# EAGLE schematic DATALOGGER_CA_ADC_V1 (EAGLE 9.5.2)

## Sheet 1 of 11
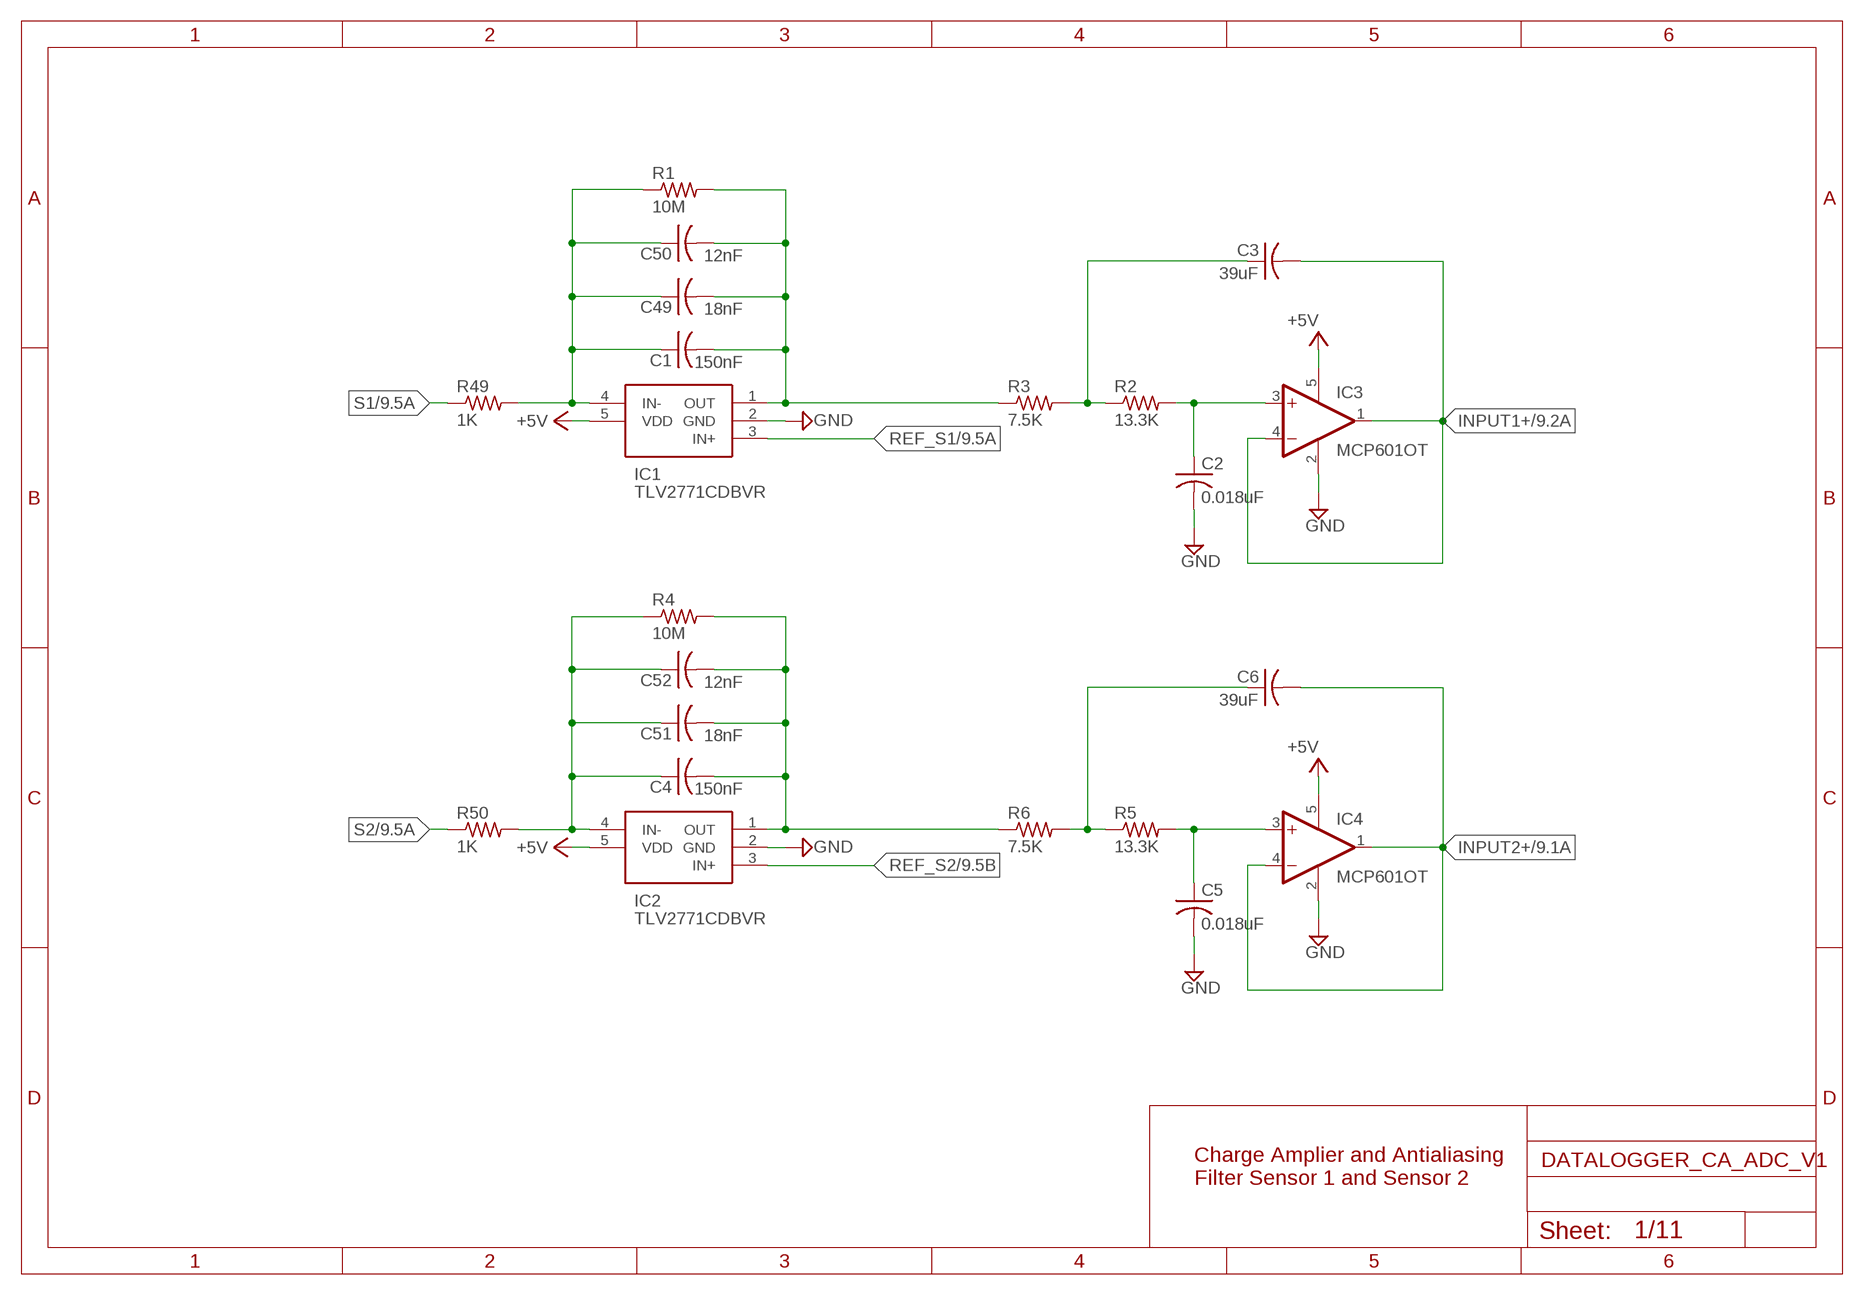
[diagram p0: schematic, sheet 1]

### Parts
C1  150nF  C-USC0805  [C0805]
C2  0.018uF  C-USC0805  [C0805]
C3  39uF  C-USC0805  [C0805]
C4  150nF  C-USC0805  [C0805]
C5  0.018uF  C-USC0805  [C0805]
C6  39uF  C-USC0805  [C0805]
C49  18nF  C-USC0805  [C0805]
C50  12nF  C-USC0805  [C0805]
C51  18nF  C-USC0805  [C0805]
C52  12nF  C-USC0805  [C0805]
IC1  TLV2771CDBVR  [SOT95P280X145-5N]
IC2  TLV2771CDBVR  [SOT95P280X145-5N]
IC3  MCP601OT  [SOT23-5]
IC4  MCP601OT  [SOT23-5]
R1  10M  R-US_R0805  [R0805]
R2  13.3K  R-US_R0805  [R0805]
R3  7.5K  R-US_R0805  [R0805]
R4  10M  R-US_R0805  [R0805]
R5  13.3K  R-US_R0805  [R0805]
R6  7.5K  R-US_R0805  [R0805]
R49  1K  R-US_R0805  [R0805]
R50  1K  R-US_R0805  [R0805]

### Nets
+5V: IC1.5(VDD) IC2.5(VDD) IC3.5(V+) IC4.5(V+) ; also sheet 2,3,4,5,6,7,8,9,10,11
GND: C2.2 C5.2 IC1.2(GND) IC2.2(GND) IC3.2(V-) IC4.2(V-) ; also sheet 2,3,4,5,6,7,8,9,10,11
INPUT1+: C3.2 IC3.1(OUT) IC3.4(-IN) ; also sheet 9
INPUT2+: C6.2 IC4.1(OUT) IC4.4(-IN) ; also sheet 9
N$2: C1.2 C49.2 C50.2 IC1.1(OUT) R1.2 R3.1
N$3: C2.1 IC3.3(+IN) R2.2
N$4: C3.1 R2.1 R3.2
N$6: C4.2 C51.2 C52.2 IC2.1(OUT) R4.2 R6.1
N$7: C5.1 IC4.3(+IN) R5.2
N$8: C6.1 R5.1 R6.2
N$49: C4.1 C51.1 C52.1 IC2.4(IN-) R4.1 R50.2
N$50: C1.1 C49.1 C50.1 IC1.4(IN-) R1.1 R49.2
REF_S1: IC1.3(IN+) ; also sheet 9,10
REF_S2: IC2.3(IN+) ; also sheet 9,10
S1: R49.1 ; also sheet 9
S2: R50.1 ; also sheet 9

### Notes on the sheet
- Charge Amplier and Antialiasing 
  Filter Sensor 1 and Sensor 2

## Sheet 2 of 11
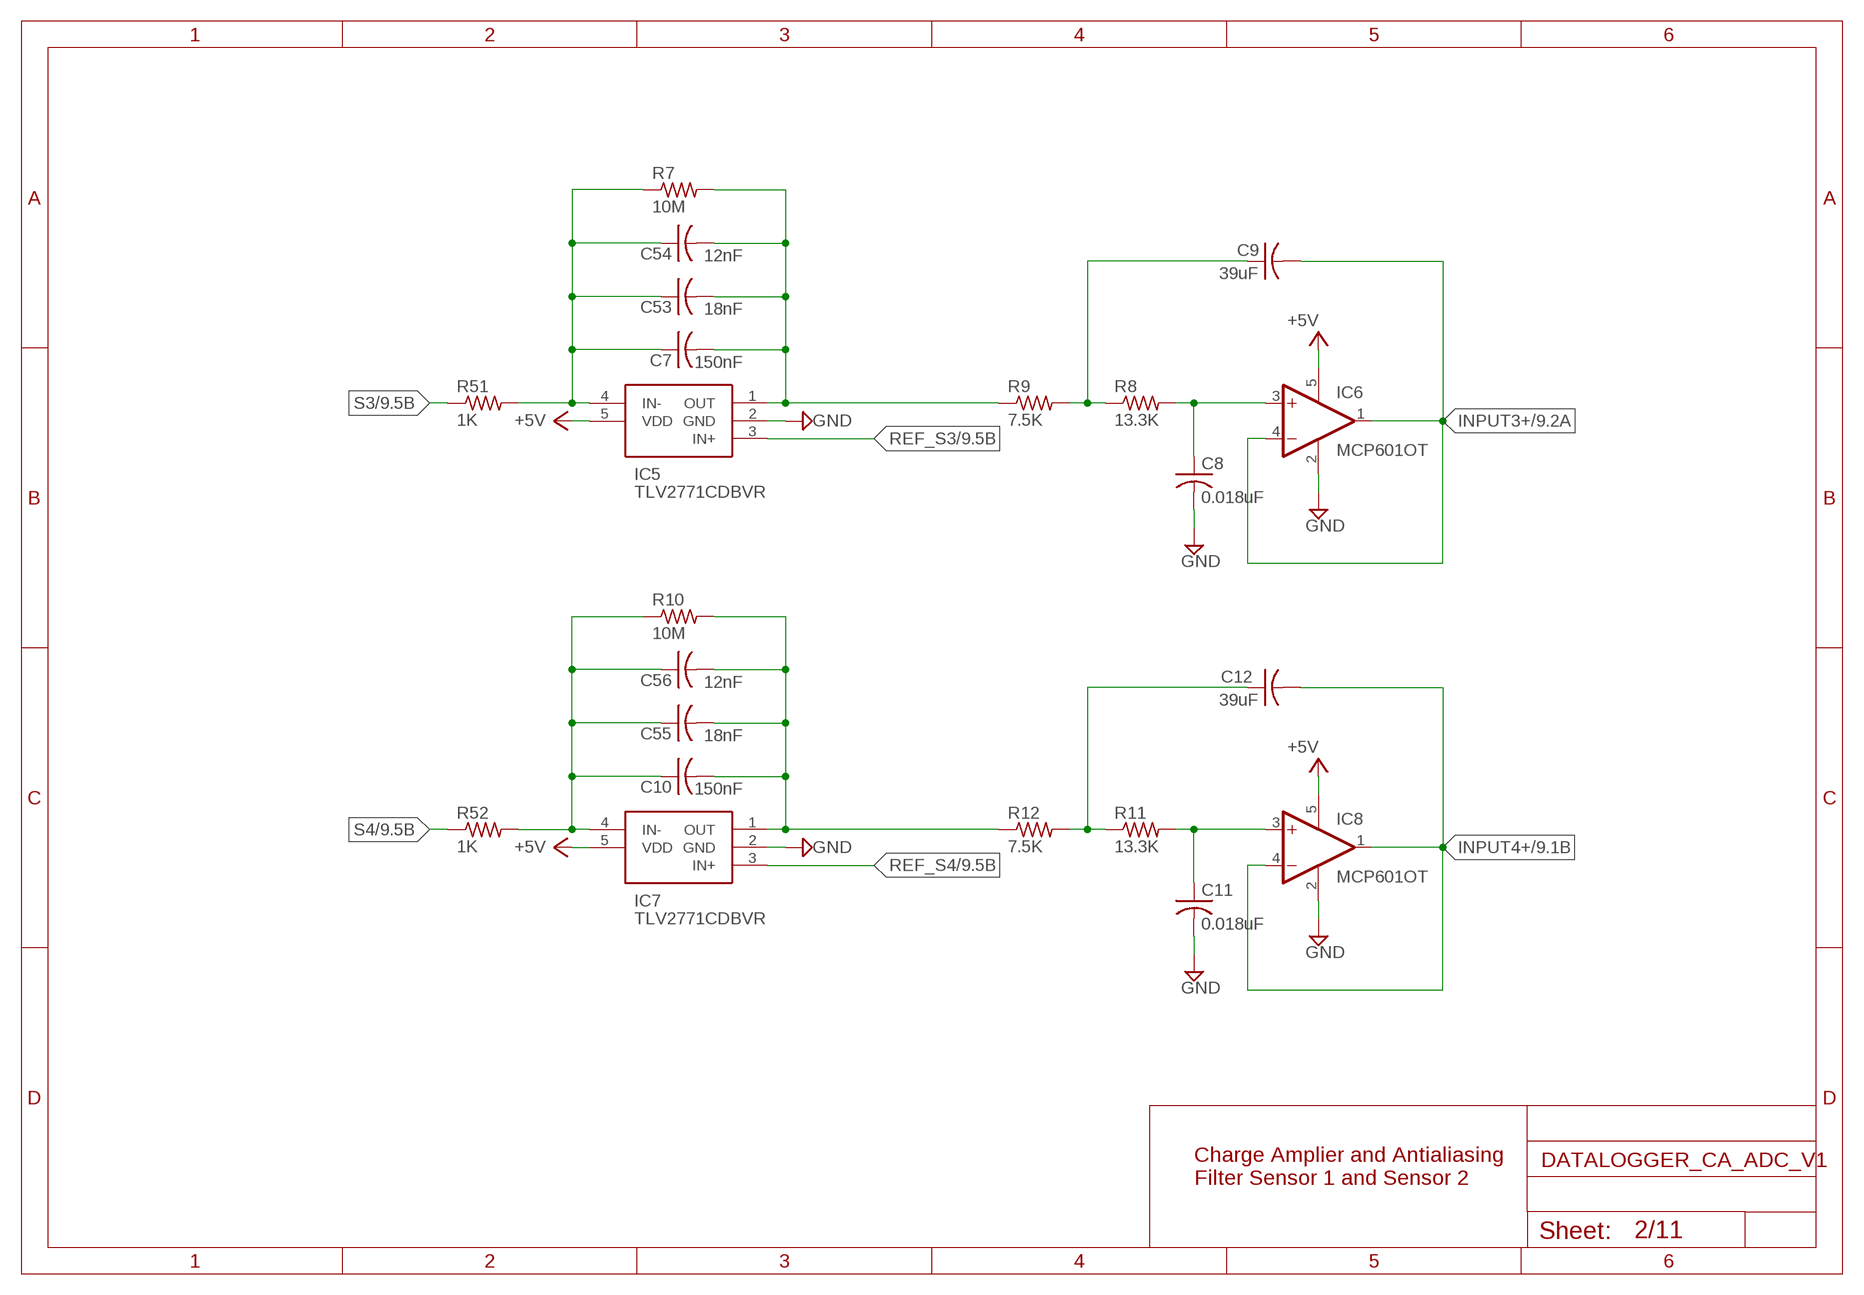
[diagram p1: schematic, sheet 2]

### Parts
C7  150nF  C-USC0805  [C0805]
C8  0.018uF  C-USC0805  [C0805]
C9  39uF  C-USC0805  [C0805]
C10  150nF  C-USC0805  [C0805]
C11  0.018uF  C-USC0805  [C0805]
C12  39uF  C-USC0805  [C0805]
C53  18nF  C-USC0805  [C0805]
C54  12nF  C-USC0805  [C0805]
C55  18nF  C-USC0805  [C0805]
C56  12nF  C-USC0805  [C0805]
IC5  TLV2771CDBVR  [SOT95P280X145-5N]
IC6  MCP601OT  [SOT23-5]
IC7  TLV2771CDBVR  [SOT95P280X145-5N]
IC8  MCP601OT  [SOT23-5]
R7  10M  R-US_R0805  [R0805]
R8  13.3K  R-US_R0805  [R0805]
R9  7.5K  R-US_R0805  [R0805]
R10  10M  R-US_R0805  [R0805]
R11  13.3K  R-US_R0805  [R0805]
R12  7.5K  R-US_R0805  [R0805]
R51  1K  R-US_R0805  [R0805]
R52  1K  R-US_R0805  [R0805]

### Nets
+5V: IC5.5(VDD) IC6.5(V+) IC7.5(VDD) IC8.5(V+) ; also sheet 1,3,4,5,6,7,8,9,10,11
GND: C8.2 C11.2 IC5.2(GND) IC6.2(V-) IC7.2(GND) IC8.2(V-) ; also sheet 1,3,4,5,6,7,8,9,10,11
INPUT3+: C9.2 IC6.1(OUT) IC6.4(-IN) ; also sheet 9
INPUT4+: C12.2 IC8.1(OUT) IC8.4(-IN) ; also sheet 9
N$1: C7.2 C53.2 C54.2 IC5.1(OUT) R7.2 R9.1
N$5: C8.1 IC6.3(+IN) R8.2
N$9: C9.1 R8.1 R9.2
N$10: C10.2 C55.2 C56.2 IC7.1(OUT) R10.2 R12.1
N$11: C11.1 IC8.3(+IN) R11.2
N$12: C12.1 R11.1 R12.2
N$51: C7.1 C53.1 C54.1 IC5.4(IN-) R7.1 R51.2
N$52: C10.1 C55.1 C56.1 IC7.4(IN-) R10.1 R52.2
REF_S3: IC5.3(IN+) ; also sheet 9,10
REF_S4: IC7.3(IN+) ; also sheet 9,10
S3: R51.1 ; also sheet 9
S4: R52.1 ; also sheet 9

### Notes on the sheet
- Charge Amplier and Antialiasing 
  Filter Sensor 1 and Sensor 2

## Sheet 3 of 11
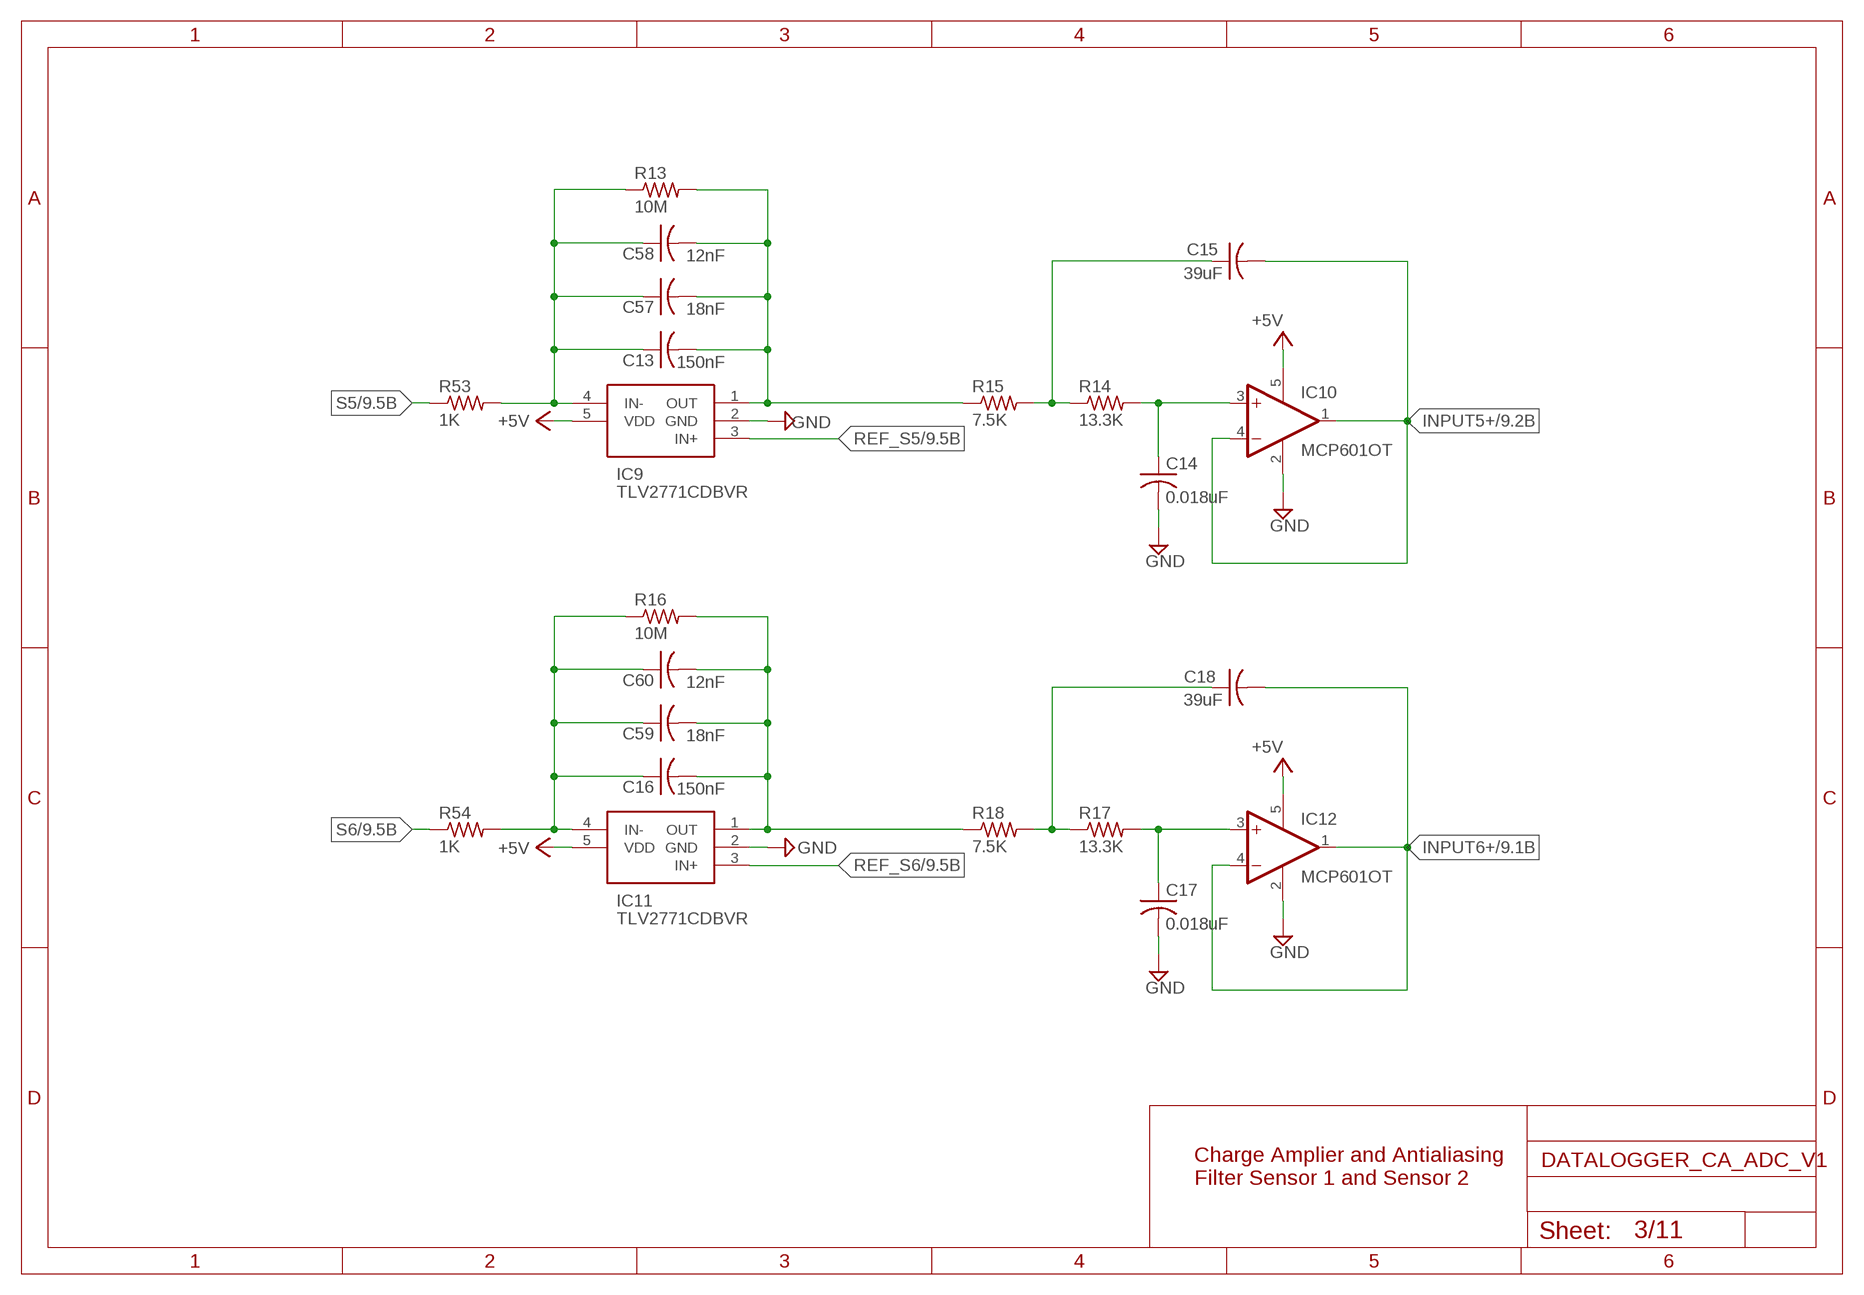
[diagram p2: schematic, sheet 3]

### Parts
C13  150nF  C-USC0805  [C0805]
C14  0.018uF  C-USC0805  [C0805]
C15  39uF  C-USC0805  [C0805]
C16  150nF  C-USC0805  [C0805]
C17  0.018uF  C-USC0805  [C0805]
C18  39uF  C-USC0805  [C0805]
C57  18nF  C-USC0805  [C0805]
C58  12nF  C-USC0805  [C0805]
C59  18nF  C-USC0805  [C0805]
C60  12nF  C-USC0805  [C0805]
IC9  TLV2771CDBVR  [SOT95P280X145-5N]
IC10  MCP601OT  [SOT23-5]
IC11  TLV2771CDBVR  [SOT95P280X145-5N]
IC12  MCP601OT  [SOT23-5]
R13  10M  R-US_R0805  [R0805]
R14  13.3K  R-US_R0805  [R0805]
R15  7.5K  R-US_R0805  [R0805]
R16  10M  R-US_R0805  [R0805]
R17  13.3K  R-US_R0805  [R0805]
R18  7.5K  R-US_R0805  [R0805]
R53  1K  R-US_R0805  [R0805]
R54  1K  R-US_R0805  [R0805]

### Nets
+5V: IC9.5(VDD) IC10.5(V+) IC11.5(VDD) IC12.5(V+) ; also sheet 1,2,4,5,6,7,8,9,10,11
GND: C14.2 C17.2 IC9.2(GND) IC10.2(V-) IC11.2(GND) IC12.2(V-) ; also sheet 1,2,4,5,6,7,8,9,10,11
INPUT5+: C15.2 IC10.1(OUT) IC10.4(-IN) ; also sheet 9
INPUT6+: C18.2 IC12.1(OUT) IC12.4(-IN) ; also sheet 9
N$13: C13.2 C57.2 C58.2 IC9.1(OUT) R13.2 R15.1
N$14: C14.1 IC10.3(+IN) R14.2
N$15: C15.1 R14.1 R15.2
N$16: C16.2 C59.2 C60.2 IC11.1(OUT) R16.2 R18.1
N$17: C17.1 IC12.3(+IN) R17.2
N$18: C18.1 R17.1 R18.2
N$53: C13.1 C57.1 C58.1 IC9.4(IN-) R13.1 R53.2
N$56: C16.1 C59.1 C60.1 IC11.4(IN-) R16.1 R54.2
REF_S5: IC9.3(IN+) ; also sheet 9,10
REF_S6: IC11.3(IN+) ; also sheet 9,10
S5: R53.1 ; also sheet 9
S6: R54.1 ; also sheet 9

### Notes on the sheet
- Charge Amplier and Antialiasing 
  Filter Sensor 1 and Sensor 2

## Sheet 4 of 11
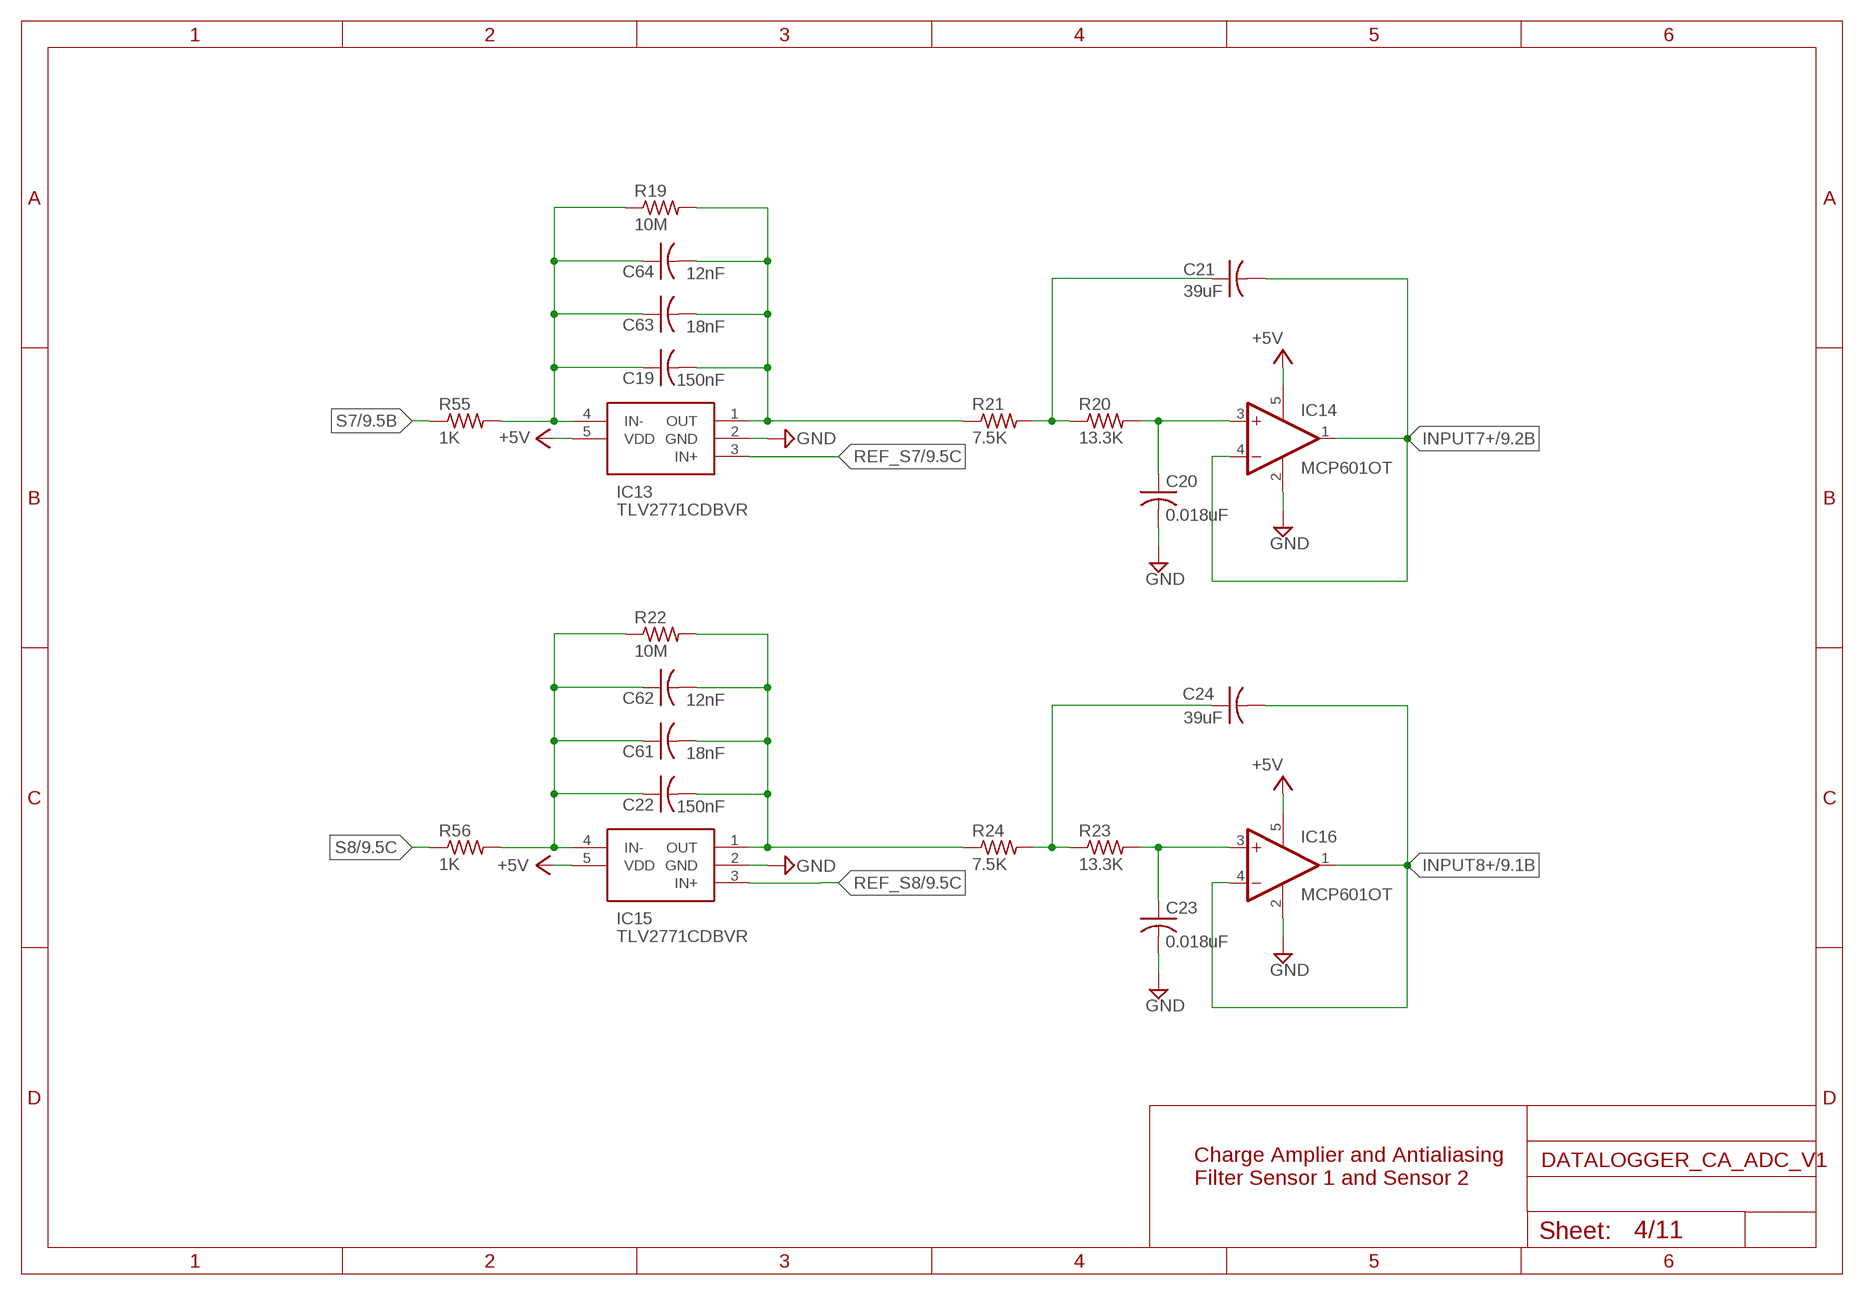
[diagram p3: schematic, sheet 4]

### Parts
C19  150nF  C-USC0805  [C0805]
C20  0.018uF  C-USC0805  [C0805]
C21  39uF  C-USC0805  [C0805]
C22  150nF  C-USC0805  [C0805]
C23  0.018uF  C-USC0805  [C0805]
C24  39uF  C-USC0805  [C0805]
C61  18nF  C-USC0805  [C0805]
C62  12nF  C-USC0805  [C0805]
C63  18nF  C-USC0805  [C0805]
C64  12nF  C-USC0805  [C0805]
IC13  TLV2771CDBVR  [SOT95P280X145-5N]
IC14  MCP601OT  [SOT23-5]
IC15  TLV2771CDBVR  [SOT95P280X145-5N]
IC16  MCP601OT  [SOT23-5]
R19  10M  R-US_R0805  [R0805]
R20  13.3K  R-US_R0805  [R0805]
R21  7.5K  R-US_R0805  [R0805]
R22  10M  R-US_R0805  [R0805]
R23  13.3K  R-US_R0805  [R0805]
R24  7.5K  R-US_R0805  [R0805]
R55  1K  R-US_R0805  [R0805]
R56  1K  R-US_R0805  [R0805]

### Nets
+5V: IC13.5(VDD) IC14.5(V+) IC15.5(VDD) IC16.5(V+) ; also sheet 1,2,3,5,6,7,8,9,10,11
GND: C20.2 C23.2 IC13.2(GND) IC14.2(V-) IC15.2(GND) IC16.2(V-) ; also sheet 1,2,3,5,6,7,8,9,10,11
INPUT7+: C21.2 IC14.1(OUT) IC14.4(-IN) ; also sheet 9
INPUT8+: C24.2 IC16.1(OUT) IC16.4(-IN) ; also sheet 9
N$19: C19.2 C63.2 C64.2 IC13.1(OUT) R19.2 R21.1
N$20: C20.1 IC14.3(+IN) R20.2
N$21: C21.1 R20.1 R21.2
N$22: C22.2 C61.2 C62.2 IC15.1(OUT) R22.2 R24.1
N$23: C23.1 IC16.3(+IN) R23.2
N$24: C24.1 R23.1 R24.2
N$54: C19.1 C63.1 C64.1 IC13.4(IN-) R19.1 R55.2
N$55: C22.1 C61.1 C62.1 IC15.4(IN-) R22.1 R56.2
REF_S7: IC13.3(IN+) ; also sheet 9,10
REF_S8: IC15.3(IN+) ; also sheet 9,10
S7: R55.1 ; also sheet 9
S8: R56.1 ; also sheet 9

### Notes on the sheet
- Charge Amplier and Antialiasing 
  Filter Sensor 1 and Sensor 2

## Sheet 5 of 11
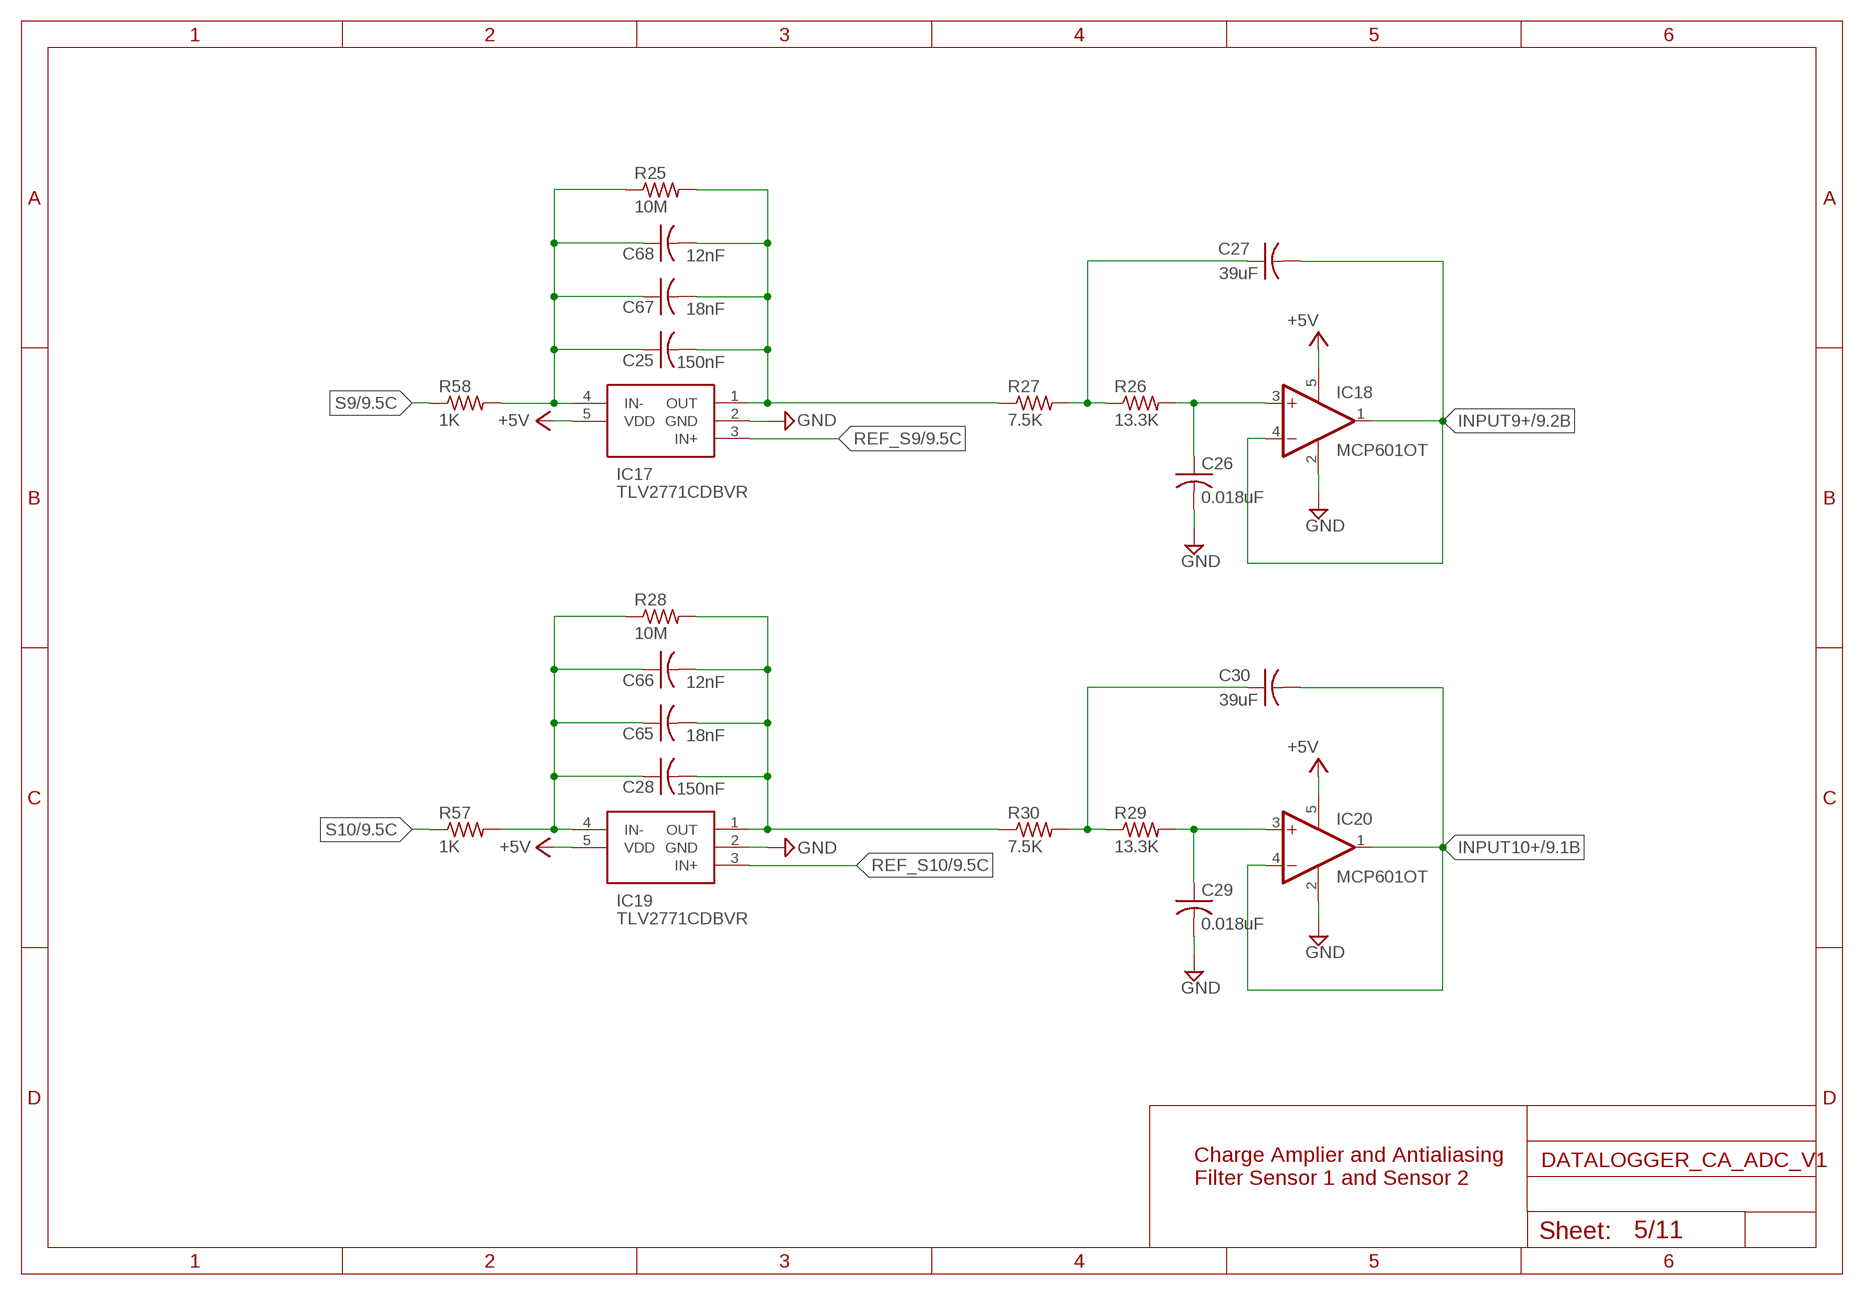
[diagram p4: schematic, sheet 5]

### Parts
C25  150nF  C-USC0805  [C0805]
C26  0.018uF  C-USC0805  [C0805]
C27  39uF  C-USC0805  [C0805]
C28  150nF  C-USC0805  [C0805]
C29  0.018uF  C-USC0805  [C0805]
C30  39uF  C-USC0805  [C0805]
C65  18nF  C-USC0805  [C0805]
C66  12nF  C-USC0805  [C0805]
C67  18nF  C-USC0805  [C0805]
C68  12nF  C-USC0805  [C0805]
IC17  TLV2771CDBVR  [SOT95P280X145-5N]
IC18  MCP601OT  [SOT23-5]
IC19  TLV2771CDBVR  [SOT95P280X145-5N]
IC20  MCP601OT  [SOT23-5]
R25  10M  R-US_R0805  [R0805]
R26  13.3K  R-US_R0805  [R0805]
R27  7.5K  R-US_R0805  [R0805]
R28  10M  R-US_R0805  [R0805]
R29  13.3K  R-US_R0805  [R0805]
R30  7.5K  R-US_R0805  [R0805]
R57  1K  R-US_R0805  [R0805]
R58  1K  R-US_R0805  [R0805]

### Nets
+5V: IC17.5(VDD) IC18.5(V+) IC19.5(VDD) IC20.5(V+) ; also sheet 1,2,3,4,6,7,8,9,10,11
GND: C26.2 C29.2 IC17.2(GND) IC18.2(V-) IC19.2(GND) IC20.2(V-) ; also sheet 1,2,3,4,6,7,8,9,10,11
INPUT9+: C27.2 IC18.1(OUT) IC18.4(-IN) ; also sheet 9
INPUT10+: C30.2 IC20.1(OUT) IC20.4(-IN) ; also sheet 9
N$25: C25.2 C67.2 C68.2 IC17.1(OUT) R25.2 R27.1
N$26: C26.1 IC18.3(+IN) R26.2
N$27: C27.1 R26.1 R27.2
N$28: C28.2 C65.2 C66.2 IC19.1(OUT) R28.2 R30.1
N$29: C29.1 IC20.3(+IN) R29.2
N$30: C30.1 R29.1 R30.2
N$57: C25.1 C67.1 C68.1 IC17.4(IN-) R25.1 R58.2
N$60: C28.1 C65.1 C66.1 IC19.4(IN-) R28.1 R57.2
REF_S9: IC17.3(IN+) ; also sheet 9,11
REF_S10: IC19.3(IN+) ; also sheet 9,11
S9: R58.1 ; also sheet 9
S10: R57.1 ; also sheet 9

### Notes on the sheet
- Charge Amplier and Antialiasing 
  Filter Sensor 1 and Sensor 2

## Sheet 6 of 11
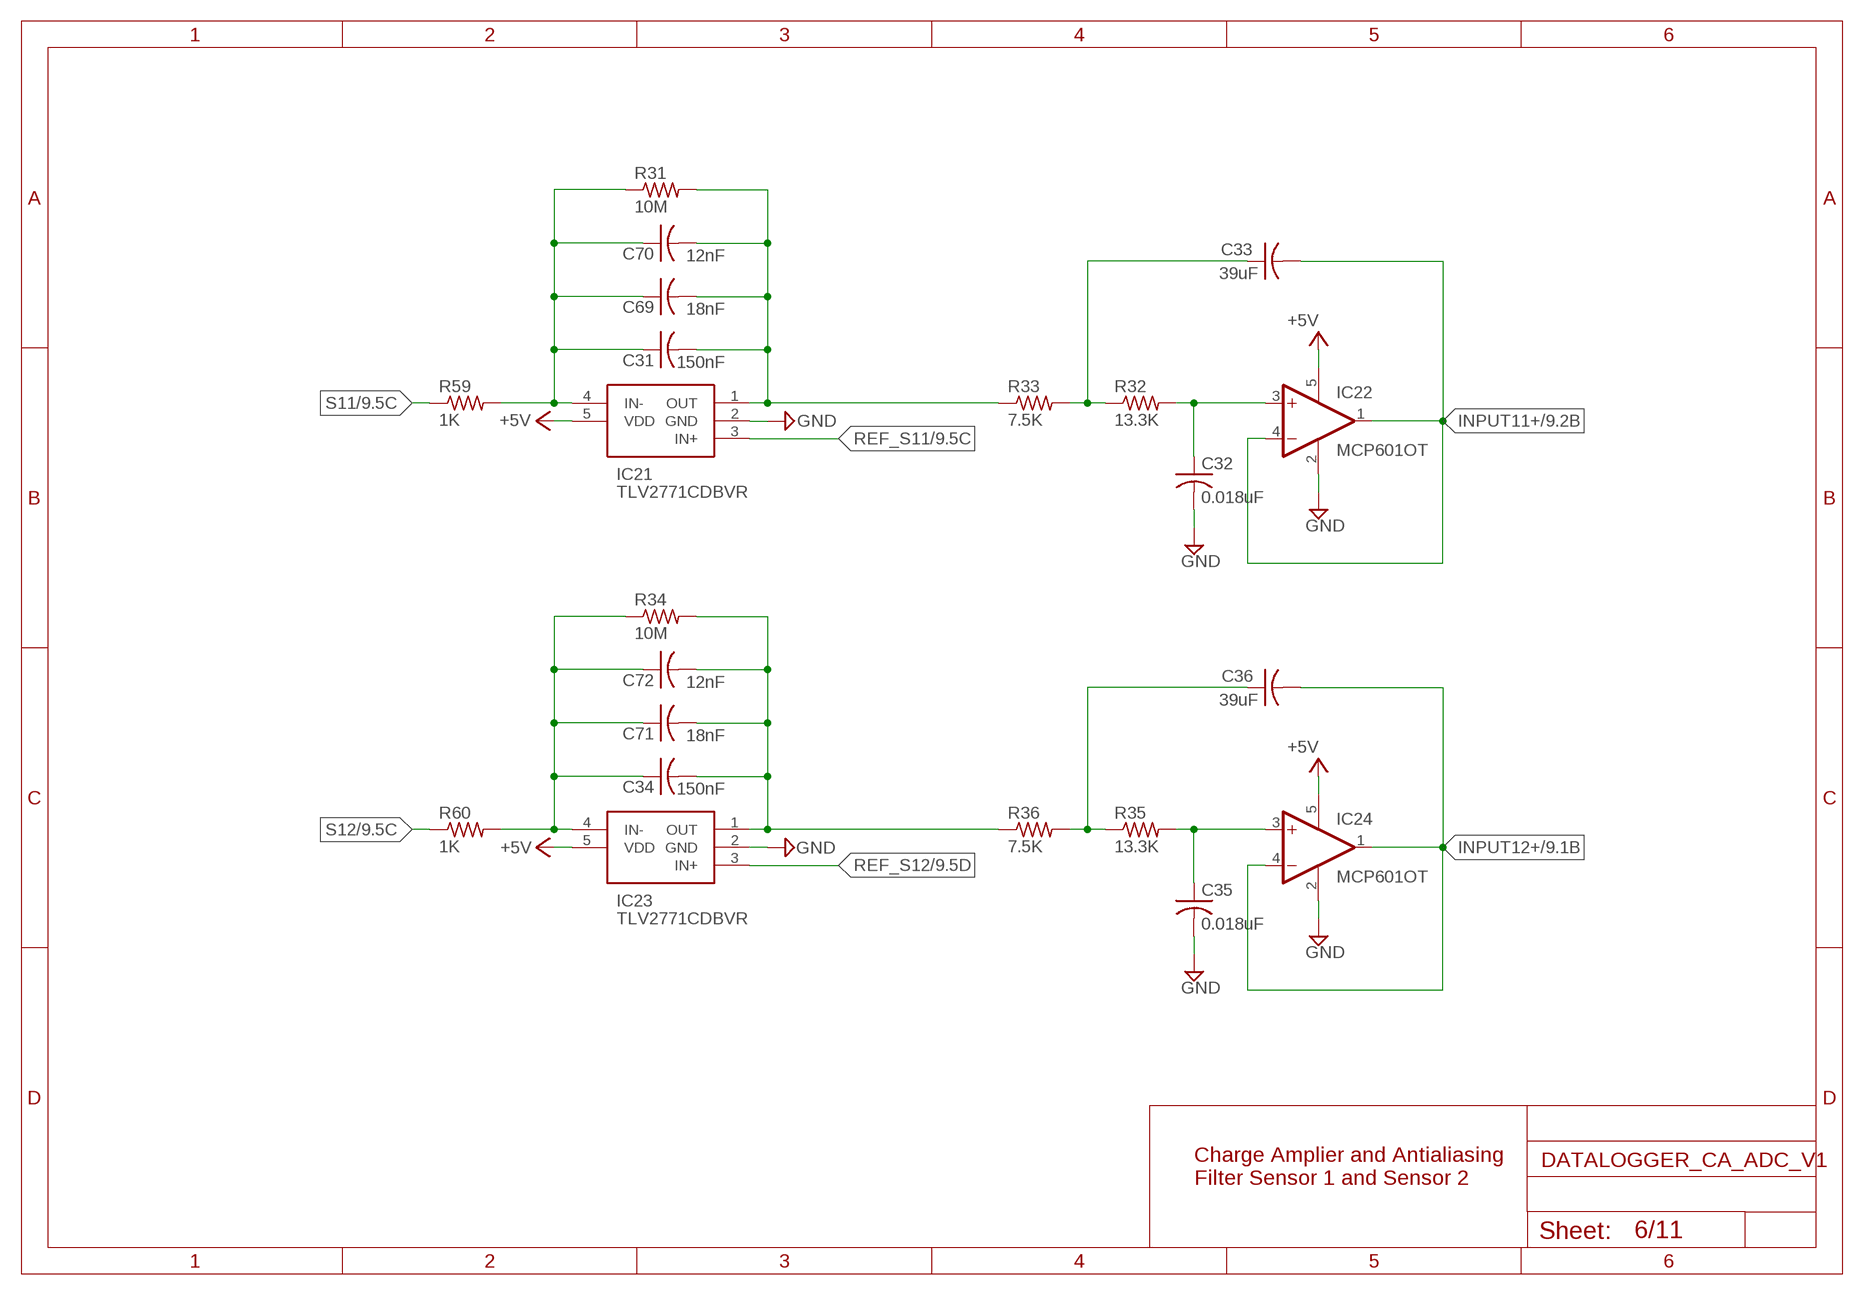
[diagram p5: schematic, sheet 6]

### Parts
C31  150nF  C-USC0805  [C0805]
C32  0.018uF  C-USC0805  [C0805]
C33  39uF  C-USC0805  [C0805]
C34  150nF  C-USC0805  [C0805]
C35  0.018uF  C-USC0805  [C0805]
C36  39uF  C-USC0805  [C0805]
C69  18nF  C-USC0805  [C0805]
C70  12nF  C-USC0805  [C0805]
C71  18nF  C-USC0805  [C0805]
C72  12nF  C-USC0805  [C0805]
IC21  TLV2771CDBVR  [SOT95P280X145-5N]
IC22  MCP601OT  [SOT23-5]
IC23  TLV2771CDBVR  [SOT95P280X145-5N]
IC24  MCP601OT  [SOT23-5]
R31  10M  R-US_R0805  [R0805]
R32  13.3K  R-US_R0805  [R0805]
R33  7.5K  R-US_R0805  [R0805]
R34  10M  R-US_R0805  [R0805]
R35  13.3K  R-US_R0805  [R0805]
R36  7.5K  R-US_R0805  [R0805]
R59  1K  R-US_R0805  [R0805]
R60  1K  R-US_R0805  [R0805]

### Nets
+5V: IC21.5(VDD) IC22.5(V+) IC23.5(VDD) IC24.5(V+) ; also sheet 1,2,3,4,5,7,8,9,10,11
GND: C32.2 C35.2 IC21.2(GND) IC22.2(V-) IC23.2(GND) IC24.2(V-) ; also sheet 1,2,3,4,5,7,8,9,10,11
INPUT11+: C33.2 IC22.1(OUT) IC22.4(-IN) ; also sheet 9
INPUT12+: C36.2 IC24.1(OUT) IC24.4(-IN) ; also sheet 9
N$31: C31.2 C69.2 C70.2 IC21.1(OUT) R31.2 R33.1
N$32: C32.1 IC22.3(+IN) R32.2
N$33: C33.1 R32.1 R33.2
N$34: C34.2 C71.2 C72.2 IC23.1(OUT) R34.2 R36.1
N$35: C35.1 IC24.3(+IN) R35.2
N$36: C36.1 R35.1 R36.2
N$58: C31.1 C69.1 C70.1 IC21.4(IN-) R31.1 R59.2
N$62: C34.1 C71.1 C72.1 IC23.4(IN-) R34.1 R60.2
REF_S11: IC21.3(IN+) ; also sheet 9,11
REF_S12: IC23.3(IN+) ; also sheet 9,11
S11: R59.1 ; also sheet 9
S12: R60.1 ; also sheet 9

### Notes on the sheet
- Charge Amplier and Antialiasing 
  Filter Sensor 1 and Sensor 2

## Sheet 7 of 11
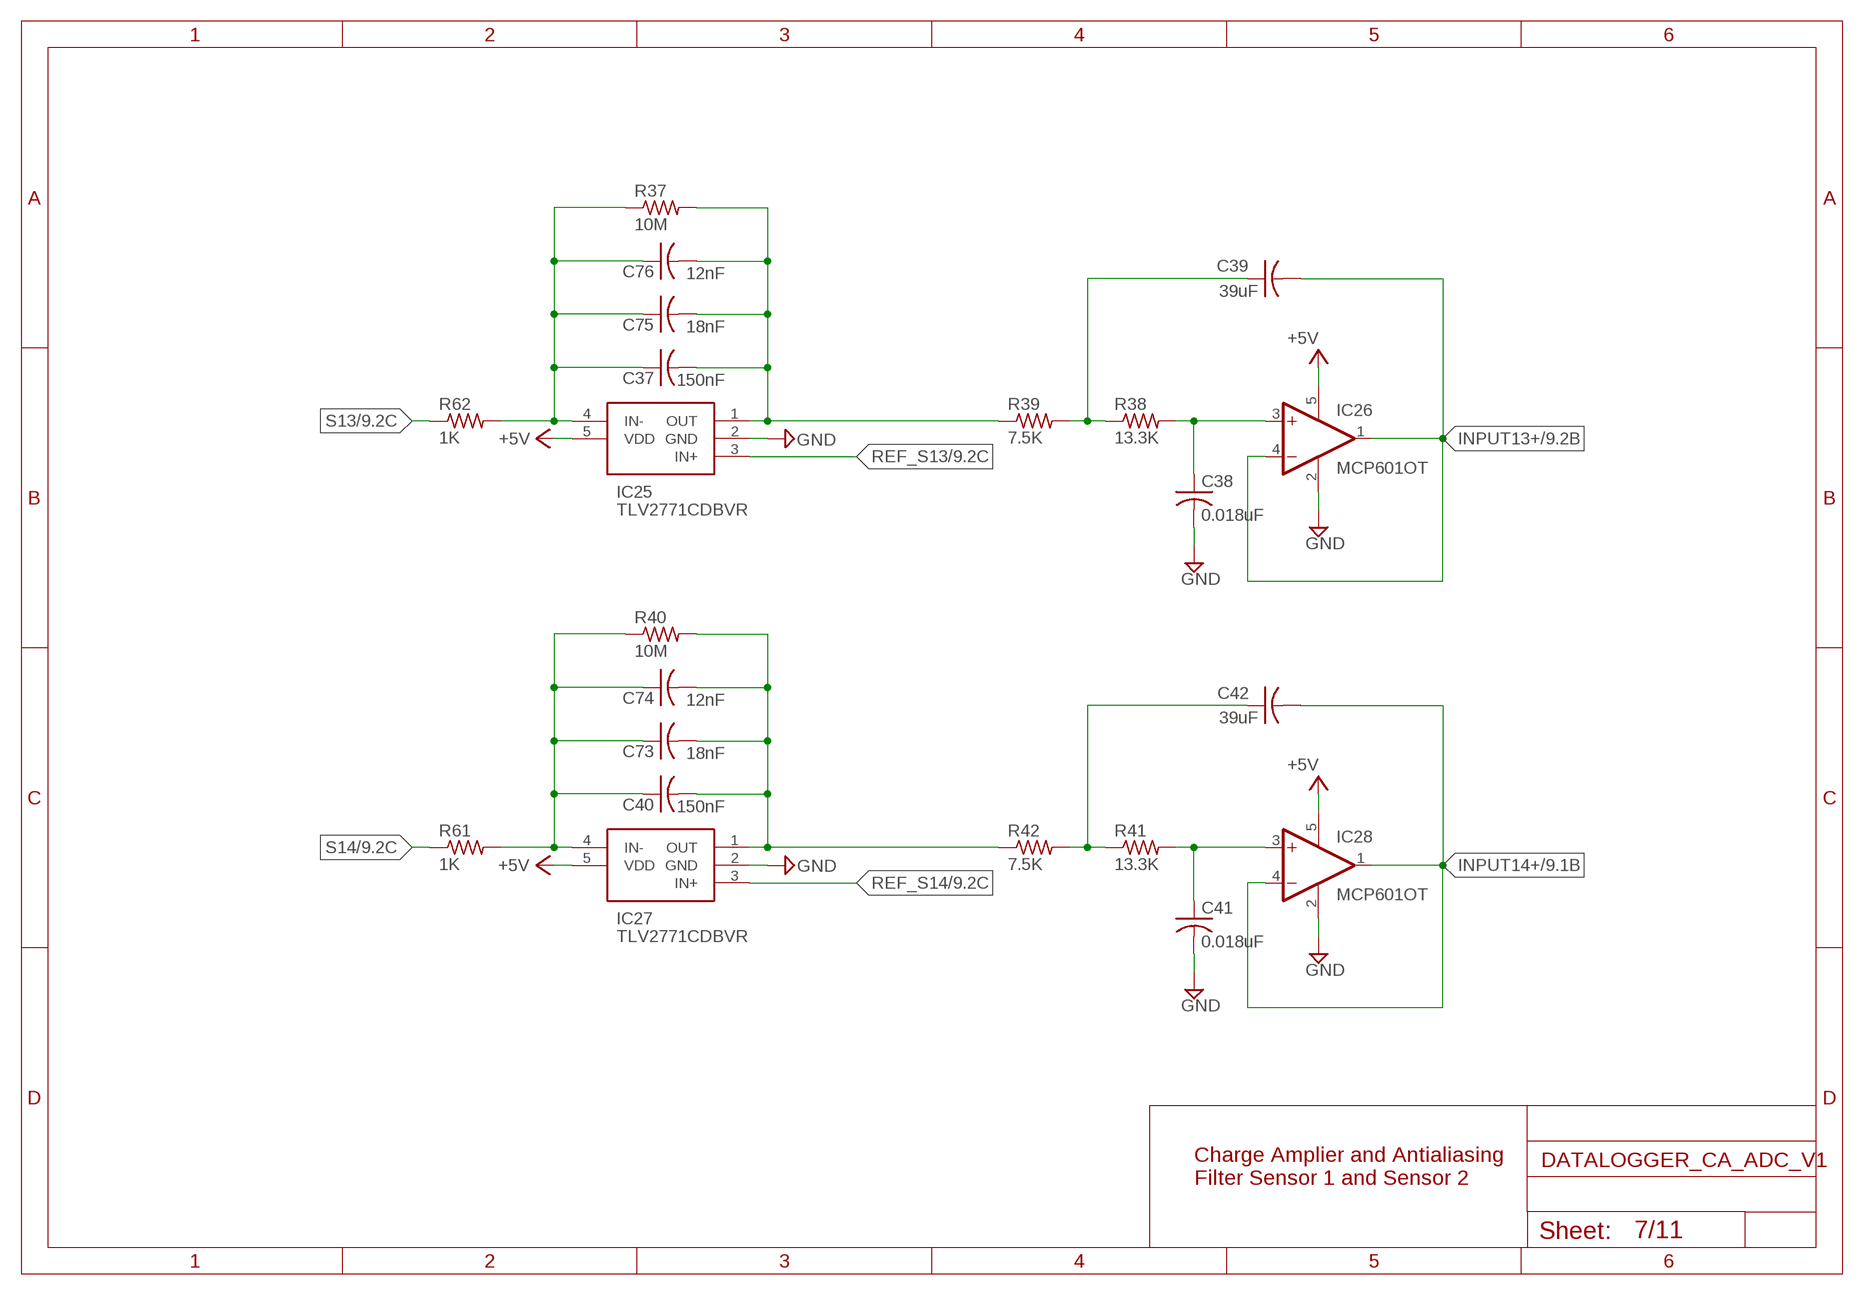
[diagram p6: schematic, sheet 7]

### Parts
C37  150nF  C-USC0805  [C0805]
C38  0.018uF  C-USC0805  [C0805]
C39  39uF  C-USC0805  [C0805]
C40  150nF  C-USC0805  [C0805]
C41  0.018uF  C-USC0805  [C0805]
C42  39uF  C-USC0805  [C0805]
C73  18nF  C-USC0805  [C0805]
C74  12nF  C-USC0805  [C0805]
C75  18nF  C-USC0805  [C0805]
C76  12nF  C-USC0805  [C0805]
IC25  TLV2771CDBVR  [SOT95P280X145-5N]
IC26  MCP601OT  [SOT23-5]
IC27  TLV2771CDBVR  [SOT95P280X145-5N]
IC28  MCP601OT  [SOT23-5]
R37  10M  R-US_R0805  [R0805]
R38  13.3K  R-US_R0805  [R0805]
R39  7.5K  R-US_R0805  [R0805]
R40  10M  R-US_R0805  [R0805]
R41  13.3K  R-US_R0805  [R0805]
R42  7.5K  R-US_R0805  [R0805]
R61  1K  R-US_R0805  [R0805]
R62  1K  R-US_R0805  [R0805]

### Nets
+5V: IC25.5(VDD) IC26.5(V+) IC27.5(VDD) IC28.5(V+) ; also sheet 1,2,3,4,5,6,8,9,10,11
GND: C38.2 C41.2 IC25.2(GND) IC26.2(V-) IC27.2(GND) IC28.2(V-) ; also sheet 1,2,3,4,5,6,8,9,10,11
INPUT13+: C39.2 IC26.1(OUT) IC26.4(-IN) ; also sheet 9
INPUT14+: C42.2 IC28.1(OUT) IC28.4(-IN) ; also sheet 9
N$37: C37.2 C75.2 C76.2 IC25.1(OUT) R37.2 R39.1
N$38: C38.1 IC26.3(+IN) R38.2
N$39: C39.1 R38.1 R39.2
N$40: C40.2 C73.2 C74.2 IC27.1(OUT) R40.2 R42.1
N$41: C41.1 IC28.3(+IN) R41.2
N$42: C42.1 R41.1 R42.2
N$59: C37.1 C75.1 C76.1 IC25.4(IN-) R37.1 R62.2
N$64: C40.1 C73.1 C74.1 IC27.4(IN-) R40.1 R61.2
REF_S13: IC25.3(IN+) ; also sheet 9,11
REF_S14: IC27.3(IN+) ; also sheet 9,11
S13: R62.1 ; also sheet 9
S14: R61.1 ; also sheet 9

### Notes on the sheet
- Charge Amplier and Antialiasing 
  Filter Sensor 1 and Sensor 2

## Sheet 8 of 11
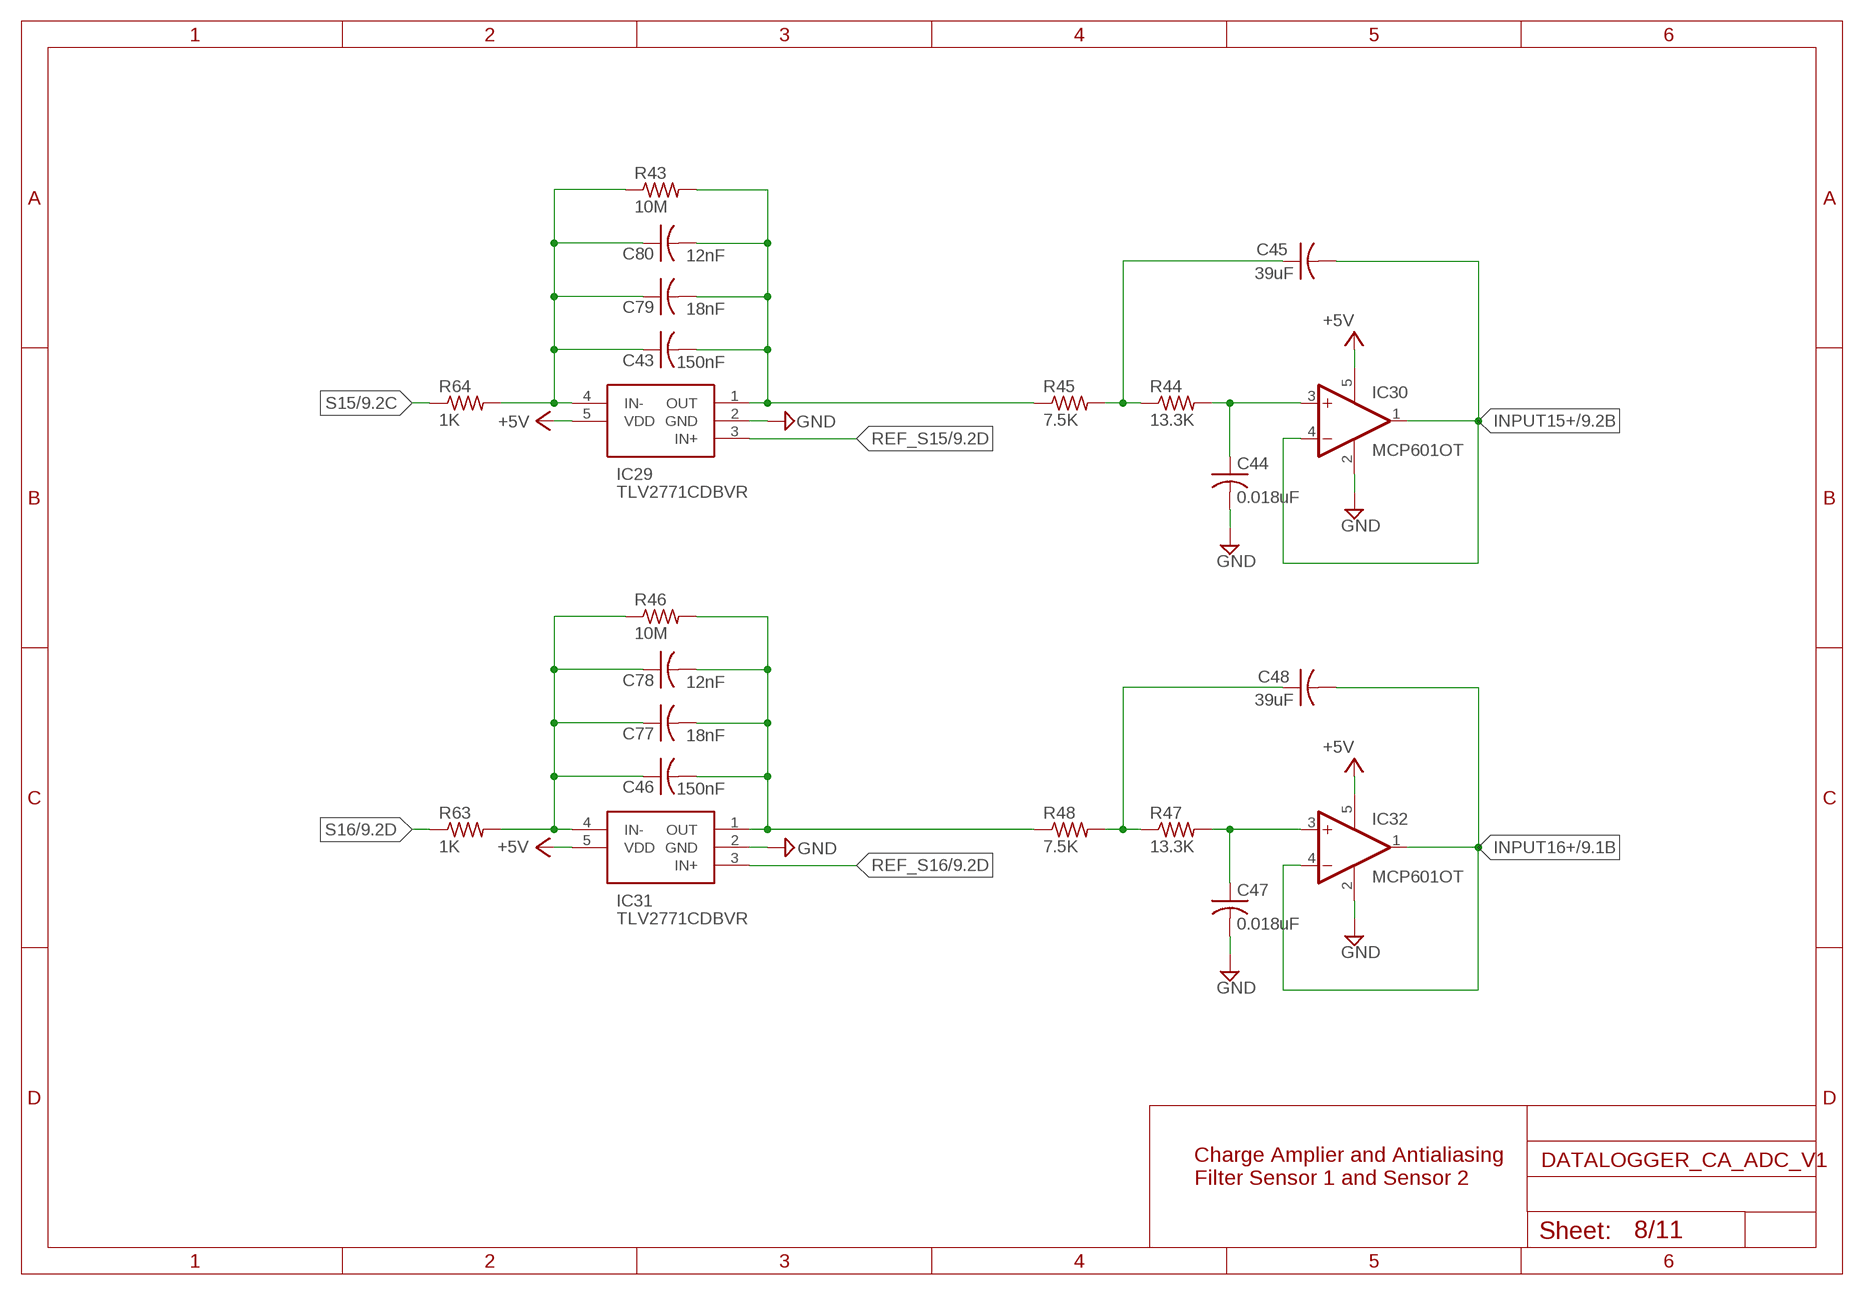
[diagram p7: schematic, sheet 8]

### Parts
C43  150nF  C-USC0805  [C0805]
C44  0.018uF  C-USC0805  [C0805]
C45  39uF  C-USC0805  [C0805]
C46  150nF  C-USC0805  [C0805]
C47  0.018uF  C-USC0805  [C0805]
C48  39uF  C-USC0805  [C0805]
C77  18nF  C-USC0805  [C0805]
C78  12nF  C-USC0805  [C0805]
C79  18nF  C-USC0805  [C0805]
C80  12nF  C-USC0805  [C0805]
IC29  TLV2771CDBVR  [SOT95P280X145-5N]
IC30  MCP601OT  [SOT23-5]
IC31  TLV2771CDBVR  [SOT95P280X145-5N]
IC32  MCP601OT  [SOT23-5]
R43  10M  R-US_R0805  [R0805]
R44  13.3K  R-US_R0805  [R0805]
R45  7.5K  R-US_R0805  [R0805]
R46  10M  R-US_R0805  [R0805]
R47  13.3K  R-US_R0805  [R0805]
R48  7.5K  R-US_R0805  [R0805]
R63  1K  R-US_R0805  [R0805]
R64  1K  R-US_R0805  [R0805]

### Nets
+5V: IC29.5(VDD) IC30.5(V+) IC31.5(VDD) IC32.5(V+) ; also sheet 1,2,3,4,5,6,7,9,10,11
GND: C44.2 C47.2 IC29.2(GND) IC30.2(V-) IC31.2(GND) IC32.2(V-) ; also sheet 1,2,3,4,5,6,7,9,10,11
INPUT15+: C45.2 IC30.1(OUT) IC30.4(-IN) ; also sheet 9
INPUT16+: C48.2 IC32.1(OUT) IC32.4(-IN) ; also sheet 9
N$43: C43.2 C79.2 C80.2 IC29.1(OUT) R43.2 R45.1
N$44: C44.1 IC30.3(+IN) R44.2
N$45: C45.1 R44.1 R45.2
N$46: C46.2 C77.2 C78.2 IC31.1(OUT) R46.2 R48.1
N$47: C47.1 IC32.3(+IN) R47.2
N$48: C48.1 R47.1 R48.2
N$61: C43.1 C79.1 C80.1 IC29.4(IN-) R43.1 R64.2
N$66: C46.1 C77.1 C78.1 IC31.4(IN-) R46.1 R63.2
REF_S15: IC29.3(IN+) ; also sheet 9,11
REF_S16: IC31.3(IN+) ; also sheet 9,11
S15: R64.1 ; also sheet 9
S16: R63.1 ; also sheet 9

### Notes on the sheet
- Charge Amplier and Antialiasing 
  Filter Sensor 1 and Sensor 2

## Sheet 9 of 11
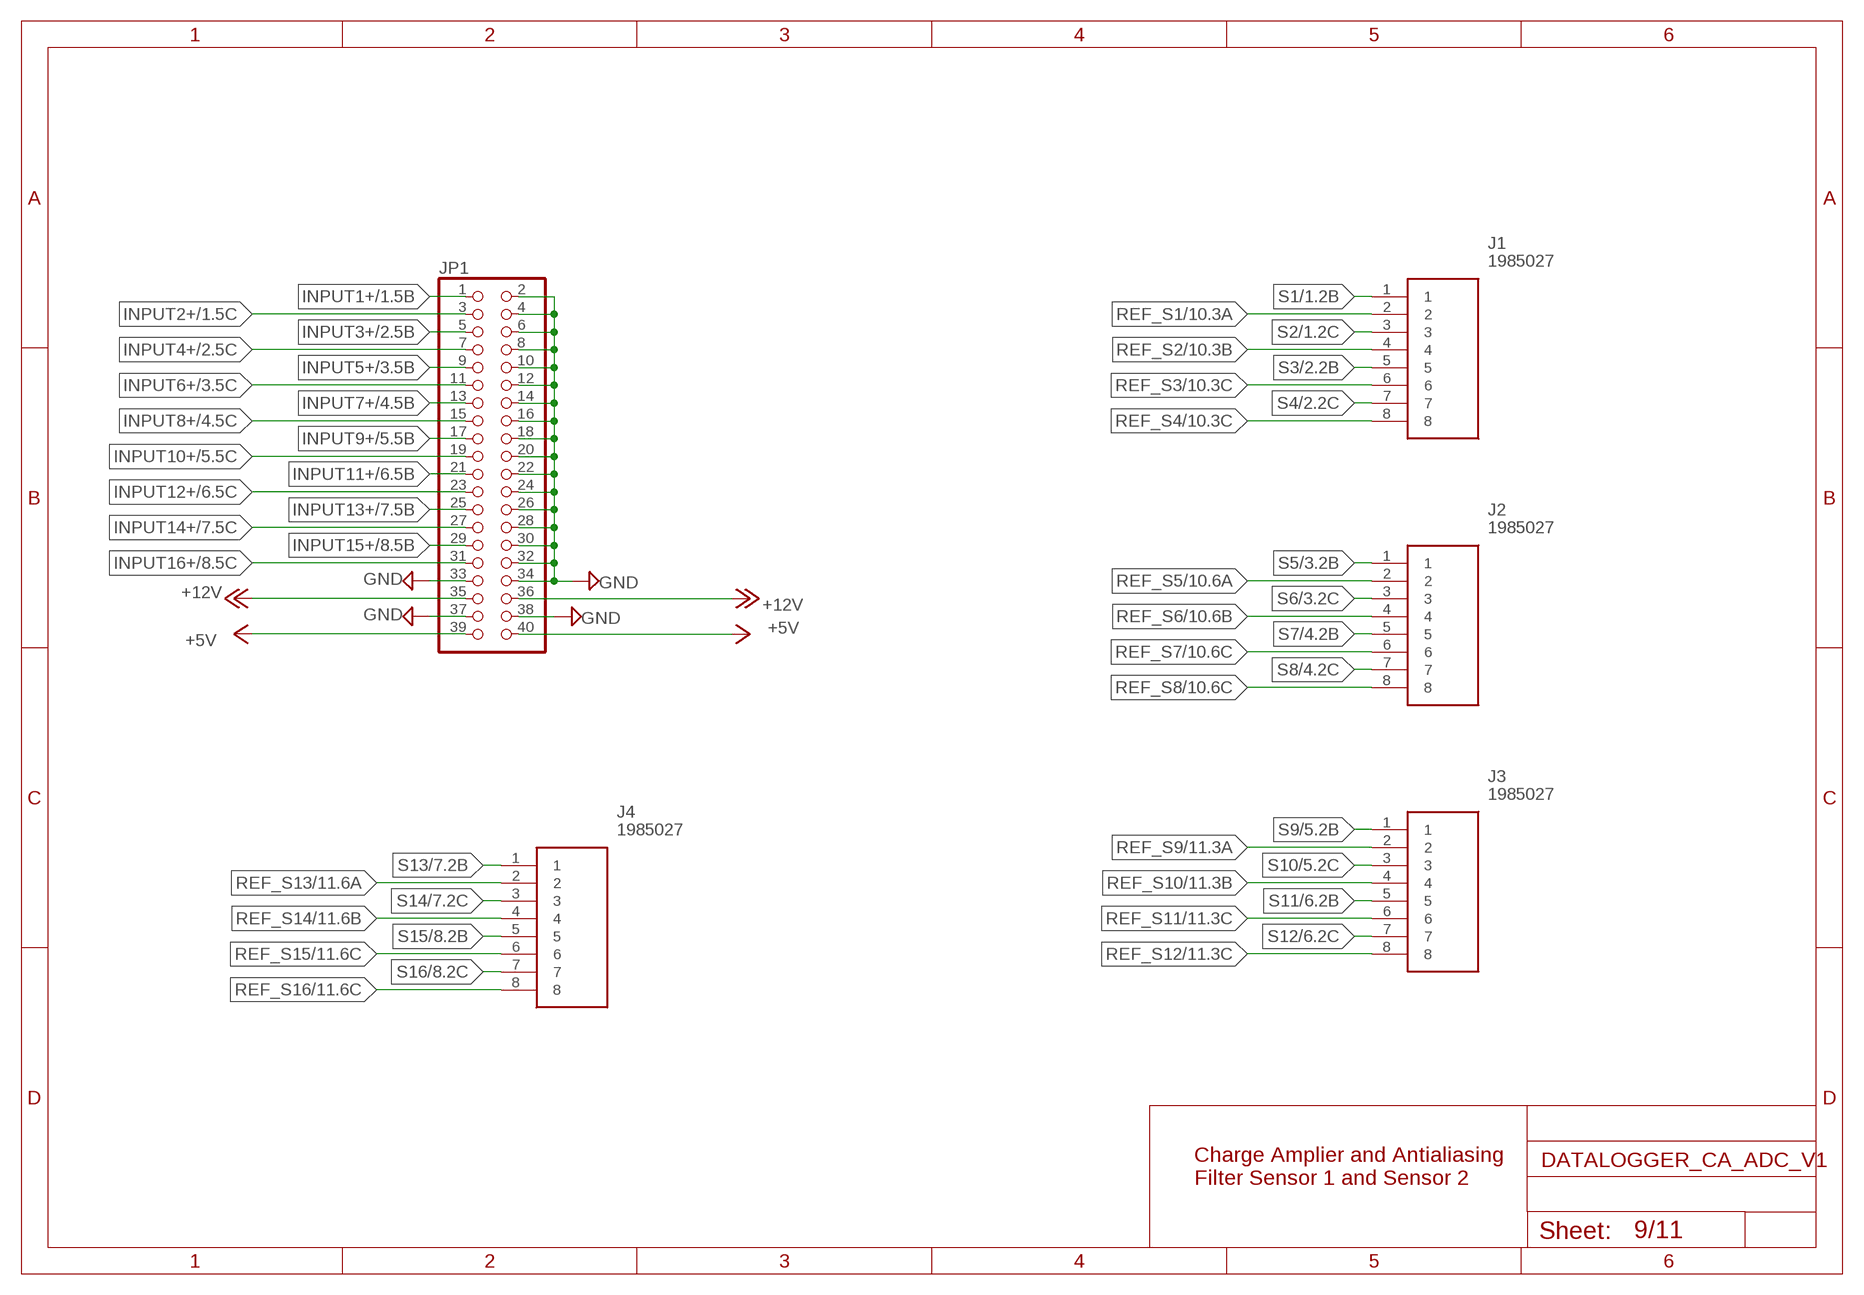
[diagram p8: schematic, sheet 9]

### Parts
J1  1985027  [1985027]
J2  1985027  [1985027]
J3  1985027  [1985027]
J4  1985027  [1985027]
JP1  PINHD-2X20  [2X20]

### Nets
+5V: JP1.39 JP1.40 ; also sheet 1,2,3,4,5,6,7,8,10,11
+12V: JP1.35 JP1.36
GND: JP1.2 JP1.4 JP1.6 JP1.8 JP1.10 JP1.12 JP1.14 JP1.16 JP1.18 JP1.20 JP1.22 JP1.24 JP1.26 JP1.28 JP1.30 JP1.32 JP1.33 JP1.34 JP1.37 JP1.38 ; also sheet 1,2,3,4,5,6,7,8,10,11
INPUT1+: JP1.1 ; also sheet 1
INPUT2+: JP1.3 ; also sheet 1
INPUT3+: JP1.5 ; also sheet 2
INPUT4+: JP1.7 ; also sheet 2
INPUT5+: JP1.9 ; also sheet 3
INPUT6+: JP1.11 ; also sheet 3
INPUT7+: JP1.13 ; also sheet 4
INPUT8+: JP1.15 ; also sheet 4
INPUT9+: JP1.17 ; also sheet 5
INPUT10+: JP1.19 ; also sheet 5
INPUT11+: JP1.21 ; also sheet 6
INPUT12+: JP1.23 ; also sheet 6
INPUT13+: JP1.25 ; also sheet 7
INPUT14+: JP1.27 ; also sheet 7
INPUT15+: JP1.29 ; also sheet 8
INPUT16+: JP1.31 ; also sheet 8
REF_S1: J1.2 ; also sheet 1,10
REF_S2: J1.4 ; also sheet 1,10
REF_S3: J1.6 ; also sheet 2,10
REF_S4: J1.8 ; also sheet 2,10
REF_S5: J2.2 ; also sheet 3,10
REF_S6: J2.4 ; also sheet 3,10
REF_S7: J2.6 ; also sheet 4,10
REF_S8: J2.8 ; also sheet 4,10
REF_S9: J3.2 ; also sheet 5,11
REF_S10: J3.4 ; also sheet 5,11
REF_S11: J3.6 ; also sheet 6,11
REF_S12: J3.8 ; also sheet 6,11
REF_S13: J4.2 ; also sheet 7,11
REF_S14: J4.4 ; also sheet 7,11
REF_S15: J4.6 ; also sheet 8,11
REF_S16: J4.8 ; also sheet 8,11
S1: J1.1 ; also sheet 1
S2: J1.3 ; also sheet 1
S3: J1.5 ; also sheet 2
S4: J1.7 ; also sheet 2
S5: J2.1 ; also sheet 3
S6: J2.3 ; also sheet 3
S7: J2.5 ; also sheet 4
S8: J2.7 ; also sheet 4
S9: J3.1 ; also sheet 5
S10: J3.3 ; also sheet 5
S11: J3.5 ; also sheet 6
S12: J3.7 ; also sheet 6
S13: J4.1 ; also sheet 7
S14: J4.3 ; also sheet 7
S15: J4.5 ; also sheet 8
S16: J4.7 ; also sheet 8

### Notes on the sheet
- Charge Amplier and Antialiasing 
  Filter Sensor 1 and Sensor 2

## Sheet 10 of 11
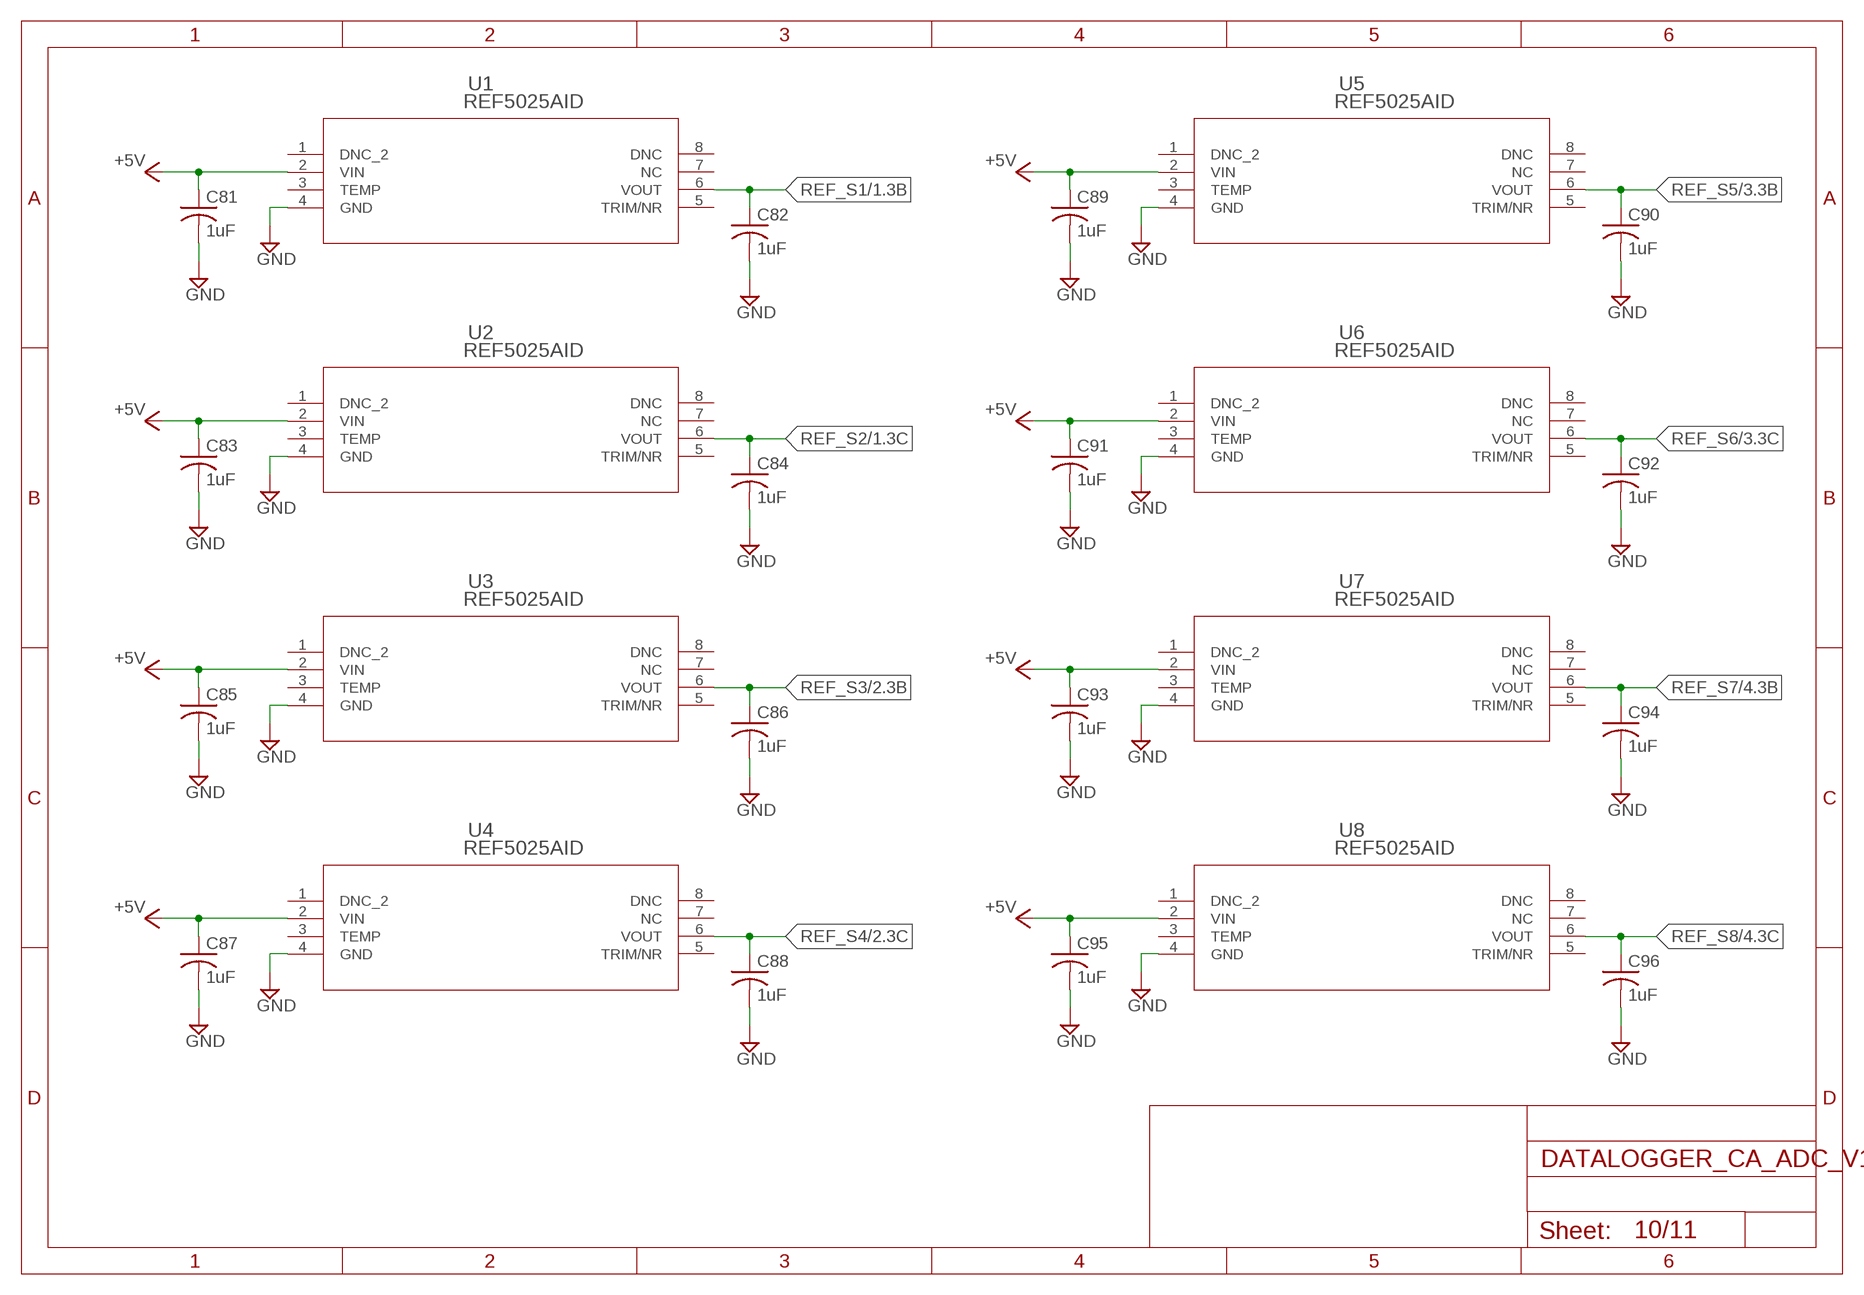
[diagram p9: schematic, sheet 10]

### Parts
C81  1uF  C-USC0805  [C0805]
C82  1uF  C-USC0805  [C0805]
C83  1uF  C-USC0805  [C0805]
C84  1uF  C-USC0805  [C0805]
C85  1uF  C-USC0805  [C0805]
C86  1uF  C-USC0805  [C0805]
C87  1uF  C-USC0805  [C0805]
C88  1uF  C-USC0805  [C0805]
C89  1uF  C-USC0805  [C0805]
C90  1uF  C-USC0805  [C0805]
C91  1uF  C-USC0805  [C0805]
C92  1uF  C-USC0805  [C0805]
C93  1uF  C-USC0805  [C0805]
C94  1uF  C-USC0805  [C0805]
C95  1uF  C-USC0805  [C0805]
C96  1uF  C-USC0805  [C0805]
U1  REF5025AID  [D8]
U2  REF5025AID  [D8]
U3  REF5025AID  [D8]
U4  REF5025AID  [D8]
U5  REF5025AID  [D8]
U6  REF5025AID  [D8]
U7  REF5025AID  [D8]
U8  REF5025AID  [D8]

### Nets
+5V: C81.1 C83.1 C85.1 C87.1 C89.1 C91.1 C93.1 C95.1 U1.2(VIN) U2.2(VIN) U3.2(VIN) U4.2(VIN) U5.2(VIN) U6.2(VIN) U7.2(VIN) U8.2(VIN) ; also sheet 1,2,3,4,5,6,7,8,9,11
GND: C81.2 C82.2 C83.2 C84.2 C85.2 C86.2 C87.2 C88.2 C89.2 C90.2 C91.2 C92.2 C93.2 C94.2 C95.2 C96.2 U1.4(GND) U2.4(GND) U3.4(GND) U4.4(GND) U5.4(GND) U6.4(GND) U7.4(GND) U8.4(GND) ; also sheet 1,2,3,4,5,6,7,8,9,11
REF_S1: C82.1 U1.6(VOUT) ; also sheet 1,9
REF_S2: C84.1 U2.6(VOUT) ; also sheet 1,9
REF_S3: C86.1 U3.6(VOUT) ; also sheet 2,9
REF_S4: C88.1 U4.6(VOUT) ; also sheet 2,9
REF_S5: C90.1 U5.6(VOUT) ; also sheet 3,9
REF_S6: C92.1 U6.6(VOUT) ; also sheet 3,9
REF_S7: C94.1 U7.6(VOUT) ; also sheet 4,9
REF_S8: C96.1 U8.6(VOUT) ; also sheet 4,9
Unconnected: U1.1(DNC_2) U1.3(TEMP) U1.5(TRIM/NR) U1.7(NC) U1.8(DNC) U2.1(DNC_2) U2.3(TEMP) U2.5(TRIM/NR) U2.7(NC) U2.8(DNC) U3.1(DNC_2) U3.3(TEMP) U3.5(TRIM/NR) U3.7(NC) U3.8(DNC) U4.1(DNC_2) U4.3(TEMP) U4.5(TRIM/NR) U4.7(NC) U4.8(DNC) U5.1(DNC_2) U5.3(TEMP) U5.5(TRIM/NR) U5.7(NC) U5.8(DNC) U6.1(DNC_2) U6.3(TEMP) U6.5(TRIM/NR) U6.7(NC) U6.8(DNC) U7.1(DNC_2) U7.3(TEMP) U7.5(TRIM/NR) U7.7(NC) U7.8(DNC) U8.1(DNC_2) U8.3(TEMP) U8.5(TRIM/NR) U8.7(NC) U8.8(DNC)

## Sheet 11 of 11
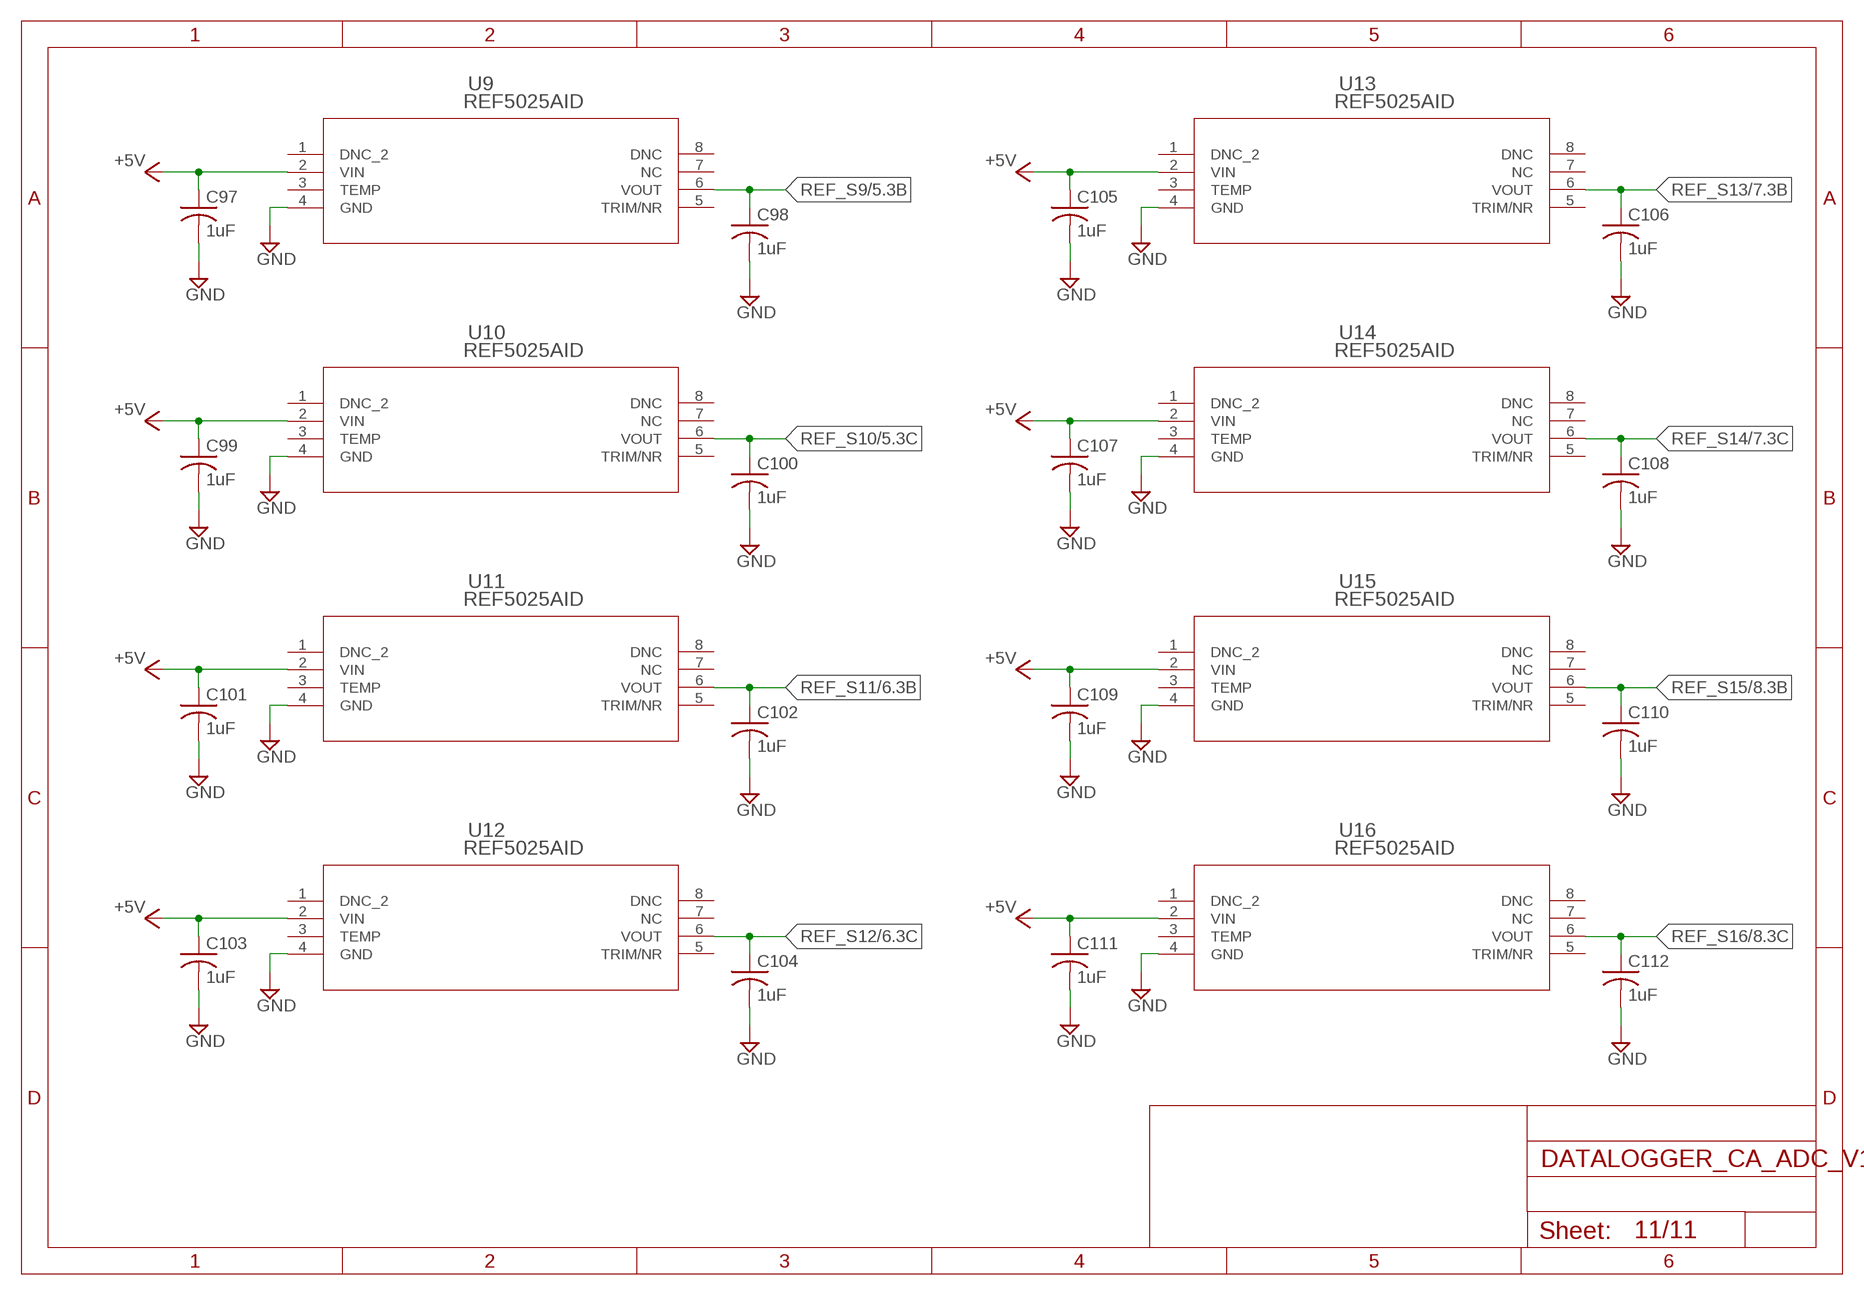
[diagram p10: schematic, sheet 11]

### Parts
C97  1uF  C-USC0805  [C0805]
C98  1uF  C-USC0805  [C0805]
C99  1uF  C-USC0805  [C0805]
C100  1uF  C-USC0805  [C0805]
C101  1uF  C-USC0805  [C0805]
C102  1uF  C-USC0805  [C0805]
C103  1uF  C-USC0805  [C0805]
C104  1uF  C-USC0805  [C0805]
C105  1uF  C-USC0805  [C0805]
C106  1uF  C-USC0805  [C0805]
C107  1uF  C-USC0805  [C0805]
C108  1uF  C-USC0805  [C0805]
C109  1uF  C-USC0805  [C0805]
C110  1uF  C-USC0805  [C0805]
C111  1uF  C-USC0805  [C0805]
C112  1uF  C-USC0805  [C0805]
U9  REF5025AID  [D8]
U10  REF5025AID  [D8]
U11  REF5025AID  [D8]
U12  REF5025AID  [D8]
U13  REF5025AID  [D8]
U14  REF5025AID  [D8]
U15  REF5025AID  [D8]
U16  REF5025AID  [D8]

### Nets
+5V: C97.1 C99.1 C101.1 C103.1 C105.1 C107.1 C109.1 C111.1 U9.2(VIN) U10.2(VIN) U11.2(VIN) U12.2(VIN) U13.2(VIN) U14.2(VIN) U15.2(VIN) U16.2(VIN) ; also sheet 1,2,3,4,5,6,7,8,9,10
GND: C97.2 C98.2 C99.2 C100.2 C101.2 C102.2 C103.2 C104.2 C105.2 C106.2 C107.2 C108.2 C109.2 C110.2 C111.2 C112.2 U9.4(GND) U10.4(GND) U11.4(GND) U12.4(GND) U13.4(GND) U14.4(GND) U15.4(GND) U16.4(GND) ; also sheet 1,2,3,4,5,6,7,8,9,10
REF_S9: C98.1 U9.6(VOUT) ; also sheet 5,9
REF_S10: C100.1 U10.6(VOUT) ; also sheet 5,9
REF_S11: C102.1 U11.6(VOUT) ; also sheet 6,9
REF_S12: C104.1 U12.6(VOUT) ; also sheet 6,9
REF_S13: C106.1 U13.6(VOUT) ; also sheet 7,9
REF_S14: C108.1 U14.6(VOUT) ; also sheet 7,9
REF_S15: C110.1 U15.6(VOUT) ; also sheet 8,9
REF_S16: C112.1 U16.6(VOUT) ; also sheet 8,9
Unconnected: U9.1(DNC_2) U9.3(TEMP) U9.5(TRIM/NR) U9.7(NC) U9.8(DNC) U10.1(DNC_2) U10.3(TEMP) U10.5(TRIM/NR) U10.7(NC) U10.8(DNC) U11.1(DNC_2) U11.3(TEMP) U11.5(TRIM/NR) U11.7(NC) U11.8(DNC) U12.1(DNC_2) U12.3(TEMP) U12.5(TRIM/NR) U12.7(NC) U12.8(DNC) U13.1(DNC_2) U13.3(TEMP) U13.5(TRIM/NR) U13.7(NC) U13.8(DNC) U14.1(DNC_2) U14.3(TEMP) U14.5(TRIM/NR) U14.7(NC) U14.8(DNC) U15.1(DNC_2) U15.3(TEMP) U15.5(TRIM/NR) U15.7(NC) U15.8(DNC) U16.1(DNC_2) U16.3(TEMP) U16.5(TRIM/NR) U16.7(NC) U16.8(DNC)

## Library data of the parts
C1-C112 = rcl:C-US: CAPACITOR, American symbol; SPICEPREFIX: C
IC1 IC2 IC5 IC7 IC9 IC11 IC13 IC15 IC17 IC19 IC21 IC23 IC25 IC27 IC29 IC31 = SamacSys_Parts:TLV2771CDBVR: Single 2.7-V High Slew Rate Rail-to-Rail Output Operational Amplifier Source: Datasheet <http://www.ti.com/lit/gpn/tlv2771>; DESCRIPTION: Single 2.7-V High Slew Rate Rail-to-Rail Output Operational Amplifier; HEIGHT: 1.45mm; MANUFACTURER_NAME: Texas Instruments; MANUFACTURER_PART_NUMBER: TLV2771CDBVR; MOUSER_PART_NUMBER: 595-TLV2771CDBVR; MOUSER_PRICE-STOCK: https://www.mouser.co.uk/ProductDetail/Texas-Instruments/TLV2771CDBVR?qs=Fg5TsMy7H4uETShD0%252BZIjw%3D%3D
IC3 IC4 IC6 IC8 IC10 IC12 IC14 IC16 IC18 IC20 IC22 IC24 IC26 IC28 IC30 IC32 = linear:MCP601: Single Op Amp 2.7V to 6.0V Single Supply CMOS Source: http://ww1.microchip.com/downloads/en/DeviceDoc/21314g.pdf
J1-J4 = SamacSys_Parts:1985027: PCB terminal block, nominal current: 8 A, rated voltage (III/2): 250 V, nominal cross section: 1.5 mm, pitch: 3.5 mm, number of positions: 8, connection method: Push-in spring connection, mounting: Wave soldering, conductor/PCB connection direction: 45 , color: green, Pin layout: Linear pinning, Solder pin [P]: 3.6 mm. Soldering legs in front area, one-rowed Source: Datasheet <https://www.phoenixcontact.com/online/portal/in?uri=pxc-oc-itemdetail:pid=1985027&library=inen&tab=1>; DESCRIPTION: PCB terminal block, nominal current: 8 A, rated voltage (III/2): 250 V, nominal cross section: 1.5 mm, pitch: 3.5 mm, number of positions: 8, connection method: Push-in spring connection, mounting: Wave soldering, conductor/PCB connection direction: 45 , color: green, Pin layout: Linear pinning, Solder pin [P]: 3.6 mm. Soldering legs in front area, one-rowed; HEIGHT: 13.1mm; MANUFACTURER_NAME: Phoenix Contact; MANUFACTURER_PART_NUMBER: 1985027; MOUSER_PART_NUMBER: 651-1985027; MOUSER_PRICE-STOCK: https://www.mouser.co.uk/ProductDetail/Phoenix-Contact/1985027/?qs=wd%252Bw3mUqFrkPN%252BA5c0%252B8Sg%3D%3D
JP1 = pinhead:PINHD-2X20: PIN HEADER
R1-R64 = rcl:R-US_: RESISTOR, American symbol; SPICEPREFIX: R
U1-U16 = REF5025:REF5025AID; DATASHEET_URL: http://www.ti.com/lit/gpn/REF5025; DESCRIPTION: Low Noise, Very Low Drift, Precision Voltage Reference; FAMILY_NAME: SERIES VOLTAGE REFERENCE; GENERIC_PART_NUMBER: REF5025; INDUSTRY_STD_PKG_TYPE: SOIC; MANUFACTURER: Texas Instruments; MANUFACTURER_PART_NUMBER: REF5025AID; PACKAGE_DESIGNATOR: D; PIN_COUNT: 8; VENDOR: Texas Instruments